# EAGLE design Breakout (EAGLE 9.5.1)
CNAME: ADS131E08 Breakout; CREVISION: 1.0; DESIGNER: Aodhán Murray

## Sheet 1 of 5: ADC Sheet
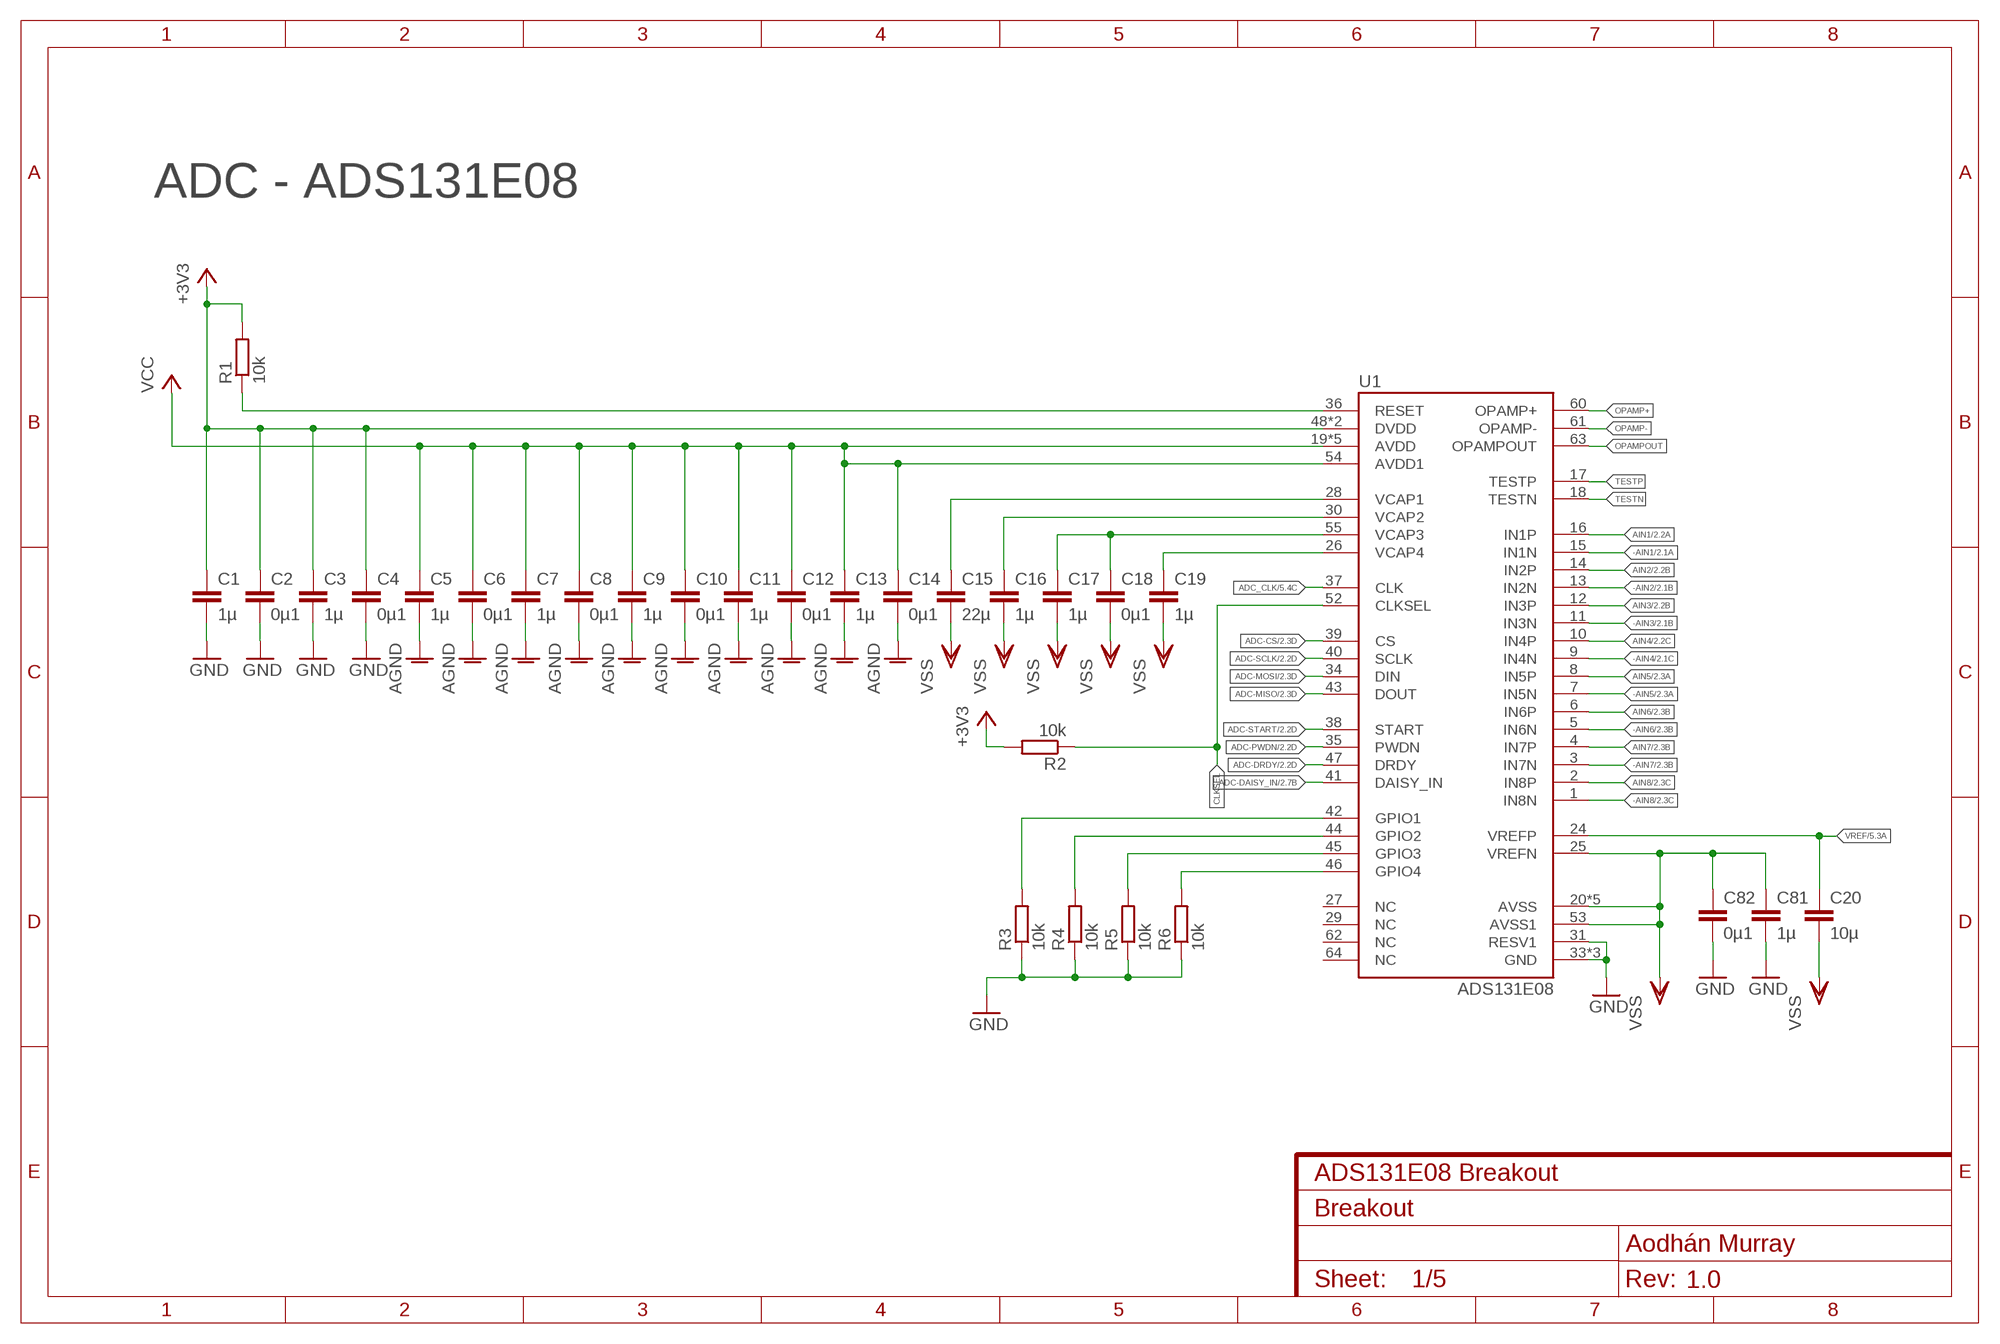
[diagram p0: schematic, sheet 1]

### Parts
C1  1µ  C-EUC0603  [C0603]
C2  0µ1  C-EUC0603  [C0603]
C3  1µ  C-EUC0603  [C0603]
C4  0µ1  C-EUC0603  [C0603]
C5  1µ  C-EUC0603  [C0603]
C6  0µ1  C-EUC0603  [C0603]
C7  1µ  C-EUC0603  [C0603]
C8  0µ1  C-EUC0603  [C0603]
C9  1µ  C-EUC0603  [C0603]
C10  0µ1  C-EUC0603  [C0603]
C11  1µ  C-EUC0603  [C0603]
C12  0µ1  C-EUC0603  [C0603]
C13  1µ  C-EUC0603  [C0603]
C14  0µ1  C-EUC0603  [C0603]
C15  22µ  C-EUC0603  [C0603]
C16  1µ  C-EUC0603  [C0603]
C17  1µ  C-EUC0603  [C0603]
C18  0µ1  C-EUC0603  [C0603]
C19  1µ  C-EUC0603  [C0603]
C20  10µ  C-EUC0603  [C0603]
C81  1µ  C-EUC0603  [C0603]
C82  0µ1  C-EUC0603  [C0603]
R1  10k  R-EU_R0603  [R0603]
R2  10k  R-EU_R0603  [R0603]
R3  10k  R-EU_R0603  [R0603]
R4  10k  R-EU_R0603  [R0603]
R5  10k  R-EU_R0603  [R0603]
R6  10k  R-EU_R0603  [R0603]
U1  ADS131E08  [TQFP-64]

### Nets
+3V3: C1.1 C2.1 C3.1 C4.1 R1.2 R2.2 U1.48(DVDD) U1.50(DVDD) ; also sheet 5
-AIN1: U1.15(IN1N) ; also sheet 2
-AIN2: U1.13(IN2N) ; also sheet 2
-AIN3: U1.11(IN3N) ; also sheet 2
-AIN4: U1.9(IN4N) ; also sheet 2
-AIN5: U1.7(IN5N) ; also sheet 2
-AIN6: U1.5(IN6N) ; also sheet 2
-AIN7: U1.3(IN7N) ; also sheet 2
-AIN8: U1.1(IN8N) ; also sheet 2
ADC-CS: U1.39(CS) ; also sheet 2
ADC-DAISY_IN: U1.41(DAISY_IN) ; also sheet 2
ADC-DRDY: U1.47(DRDY) ; also sheet 2
ADC-MISO: U1.43(DOUT) ; also sheet 2
ADC-MOSI: U1.34(DIN) ; also sheet 2
ADC-PWDN: U1.35(PWDN) ; also sheet 2
ADC-RST: R1.1 U1.36(RESET) ; also sheet 2
ADC-SCLK: U1.40(SCLK) ; also sheet 2
ADC-START: U1.38(START) ; also sheet 2
ADC_CLK: U1.37(CLK) ; also sheet 5
AIN1: U1.16(IN1P) ; also sheet 2
AIN2: U1.14(IN2P) ; also sheet 2
AIN3: U1.12(IN3P) ; also sheet 2
AIN4: U1.10(IN4P) ; also sheet 2
AIN5: U1.8(IN5P) ; also sheet 2
AIN6: U1.6(IN6P) ; also sheet 2
AIN7: U1.4(IN7P) ; also sheet 2
AIN8: U1.2(IN8P) ; also sheet 2
CLKSEL: R2.1 U1.52(CLKSEL)
GND: C1.2 C2.2 C3.2 C4.2 C5.2 C6.2 C7.2 C8.2 C9.2 C10.2 C11.2 C12.2 C13.2 C14.2 C81.2 C82.2 R3.1 R4.1 R5.1 R6.1 U1.31(RESV1) U1.33(GND) U1.49(GND) U1.51(GND) ; supply symbol labelled AGND ; also sheet 2,3,4,5
GPIO1: R3.2 U1.42(GPIO1)
GPIO2: R4.2 U1.44(GPIO2)
GPIO3: R5.2 U1.45(GPIO3)
GPIO4: R6.2 U1.46(GPIO4)
OPAMP+: U1.60(OPAMP+)
OPAMP-: U1.61(OPAMP-)
OPAMPOUT: U1.63(OPAMPOUT)
TESTN: U1.18(TESTN)
TESTP: U1.17(TESTP)
VCAP1: C15.1 U1.28(VCAP1)
VCAP2: C16.1 U1.30(VCAP2)
VCAP3: C17.1 C18.1 U1.55(VCAP3)
VCAP4: C19.1 U1.26(VCAP4)
VCC: C5.1 C6.1 C7.1 C8.1 C9.1 C10.1 C11.1 C12.1 C13.1 C14.1 U1.19(AVDD) U1.21(AVDD) U1.22(AVDD) U1.54(AVDD1) U1.56(AVDD) U1.59(AVDD) ; also sheet 3,4,5
VREF: C20.1 U1.24(VREFP) ; also sheet 5
VSS: C15.2 C16.2 C17.2 C18.2 C19.2 C20.2 C81.1 C82.1 U1.20(AVSS) U1.23(AVSS) U1.25(VREFN) U1.32(AVSS) U1.53(AVSS1) U1.57(AVSS) U1.58(AVSS) ; also sheet 3,4,5
Unconnected: U1.27(NC) U1.29(NC) U1.62(NC) U1.64(NC)

### Notes on the sheet
- ADC - ADS131E08

## Sheet 2 of 5: Connectors
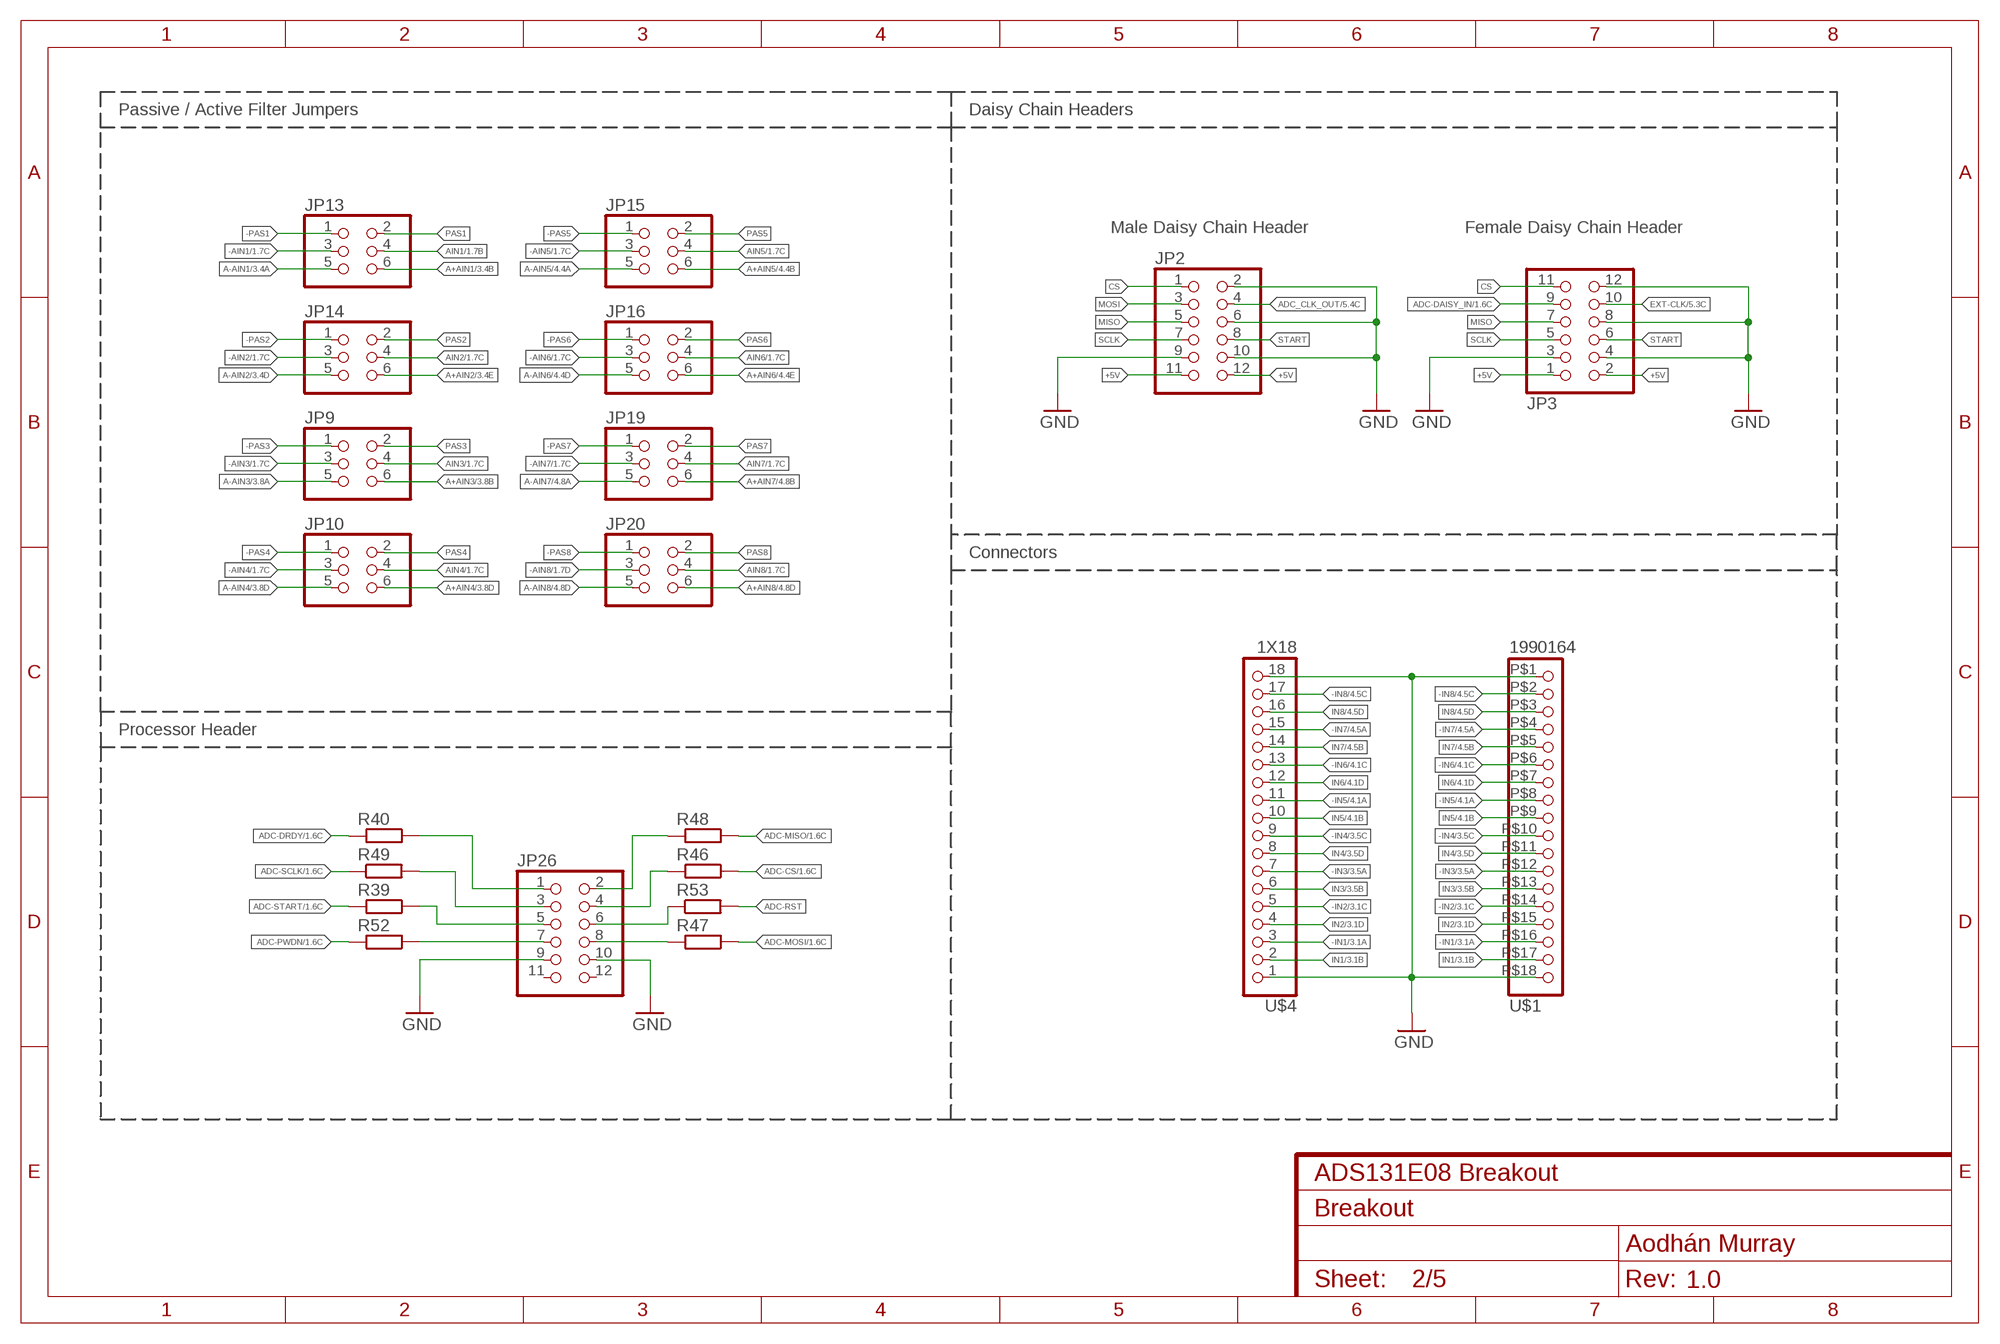
[diagram p1: schematic, sheet 2]

### Parts
JP2  PINHD-2X6/90  [2X06/90]
JP3  PINHD-2X6/90  [2X06/90]
JP9  PINHD-2X3  [2X03]
JP10  PINHD-2X3  [2X03]
JP13  PINHD-2X3  [2X03]
JP14  PINHD-2X3  [2X03]
JP15  PINHD-2X3  [2X03]
JP16  PINHD-2X3  [2X03]
JP19  PINHD-2X3  [2X03]
JP20  PINHD-2X3  [2X03]
JP26  PINHD-2X6/90  [2X06/90]
R39  R-EU_R0603  [R0603]
R40  R-EU_R0603  [R0603]
R46  R-EU_R0603  [R0603]
R47  R-EU_R0603  [R0603]
R48  R-EU_R0603  [R0603]
R49  R-EU_R0603  [R0603]
R52  R-EU_R0603  [R0603]
R53  R-EU_R0603  [R0603]
U$1  1990164  [PTSA-2.5-Z]
U$4  1X18  [1X18/90]

### Nets
+5V: JP2.11 JP2.12 JP3.1 JP3.2 ; also sheet 5
-AIN1: JP13.3 ; also sheet 1
-AIN2: JP14.3 ; also sheet 1
-AIN3: JP9.3 ; also sheet 1
-AIN4: JP10.3 ; also sheet 1
-AIN5: JP15.3 ; also sheet 1
-AIN6: JP16.3 ; also sheet 1
-AIN7: JP19.3 ; also sheet 1
-AIN8: JP20.3 ; also sheet 1
-IN1: U$1.P$16 U$4.3 ; also sheet 3
-IN2: U$1.P$14 U$4.5 ; also sheet 3
-IN3: U$1.P$12 U$4.7 ; also sheet 3
-IN4: U$1.P$10 U$4.9 ; also sheet 3
-IN5: U$1.P$8 U$4.11 ; also sheet 4
-IN6: U$1.P$6 U$4.13 ; also sheet 4
-IN7: U$1.P$4 U$4.15 ; also sheet 4
-IN8: U$1.P$2 U$4.17 ; also sheet 4
-PAS1: JP13.1 ; also sheet 3
-PAS2: JP14.1 ; also sheet 3
-PAS3: JP9.1 ; also sheet 3
-PAS4: JP10.1 ; also sheet 3
-PAS5: JP15.1 ; also sheet 4
-PAS6: JP16.1 ; also sheet 4
-PAS7: JP19.1 ; also sheet 4
-PAS8: JP20.1 ; also sheet 4
A+AIN1: JP13.6 ; also sheet 3
A+AIN2: JP14.6 ; also sheet 3
A+AIN3: JP9.6 ; also sheet 3
A+AIN4: JP10.6 ; also sheet 3
A+AIN5: JP15.6 ; also sheet 4
A+AIN6: JP16.6 ; also sheet 4
A+AIN7: JP19.6 ; also sheet 4
A+AIN8: JP20.6 ; also sheet 4
A-AIN1: JP13.5 ; also sheet 3
A-AIN2: JP14.5 ; also sheet 3
A-AIN3: JP9.5 ; also sheet 3
A-AIN4: JP10.5 ; also sheet 3
A-AIN5: JP15.5 ; also sheet 4
A-AIN6: JP16.5 ; also sheet 4
A-AIN7: JP19.5 ; also sheet 4
A-AIN8: JP20.5 ; also sheet 4
ADC-CS: R46.1 ; also sheet 1
ADC-DAISY_IN: JP3.9 ; also sheet 1
ADC-DRDY: R40.2 ; also sheet 1
ADC-MISO: R48.1 ; also sheet 1
ADC-MOSI: R47.1 ; also sheet 1
ADC-PWDN: R52.2 ; also sheet 1
ADC-RST: R53.2 ; also sheet 1
ADC-SCLK: R49.1 ; also sheet 1
ADC-START: R39.2 ; also sheet 1
ADC_CLK_OUT: JP2.4 ; also sheet 5
AIN1: JP13.4 ; also sheet 1
AIN2: JP14.4 ; also sheet 1
AIN3: JP9.4 ; also sheet 1
AIN4: JP10.4 ; also sheet 1
AIN5: JP15.4 ; also sheet 1
AIN6: JP16.4 ; also sheet 1
AIN7: JP19.4 ; also sheet 1
AIN8: JP20.4 ; also sheet 1
CS: JP2.1 JP3.11 JP26.4 R46.2
DRDY: JP26.1 R40.1 ; also sheet 5
EXT-CLK: JP3.10 ; also sheet 5
GND: JP2.2 JP2.6 JP2.9 JP2.10 JP3.3 JP3.4 JP3.8 JP3.12 JP26.9 JP26.10 U$1.P$1 U$1.P$18 U$4.1 U$4.18 ; also sheet 1,3,4,5
IN1: U$1.P$17 U$4.2 ; also sheet 3
IN2: U$1.P$15 U$4.4 ; also sheet 3
IN3: U$1.P$13 U$4.6 ; also sheet 3
IN4: U$1.P$11 U$4.8 ; also sheet 3
IN5: U$1.P$9 U$4.10 ; also sheet 4
IN6: U$1.P$7 U$4.12 ; also sheet 4
IN7: U$1.P$5 U$4.14 ; also sheet 4
IN8: U$1.P$3 U$4.16 ; also sheet 4
MISO: JP2.5 JP3.7 JP26.2 R48.2
MOSI: JP2.3 JP26.8 R47.2
PAS1: JP13.2 ; also sheet 3
PAS2: JP14.2 ; also sheet 3
PAS3: JP9.2 ; also sheet 3
PAS4: JP10.2 ; also sheet 3
PAS5: JP15.2 ; also sheet 4
PAS6: JP16.2 ; also sheet 4
PAS7: JP19.2 ; also sheet 4
PAS8: JP20.2 ; also sheet 4
PWDN: JP26.7 R52.1
RST: JP26.6 R53.1
SCLK: JP2.7 JP3.5 JP26.3 R49.2
START: JP2.8 JP3.6 JP26.5 R39.1
Unconnected: JP26.11 JP26.12

### Notes on the sheet
- Passive / Active Filter Jumpers | Daisy Chain Headers
- Male Daisy Chain Header | Female Daisy Chain Header
- Connectors
- Processor Header

## Sheet 3 of 5: Analog Front-End Sheet 1
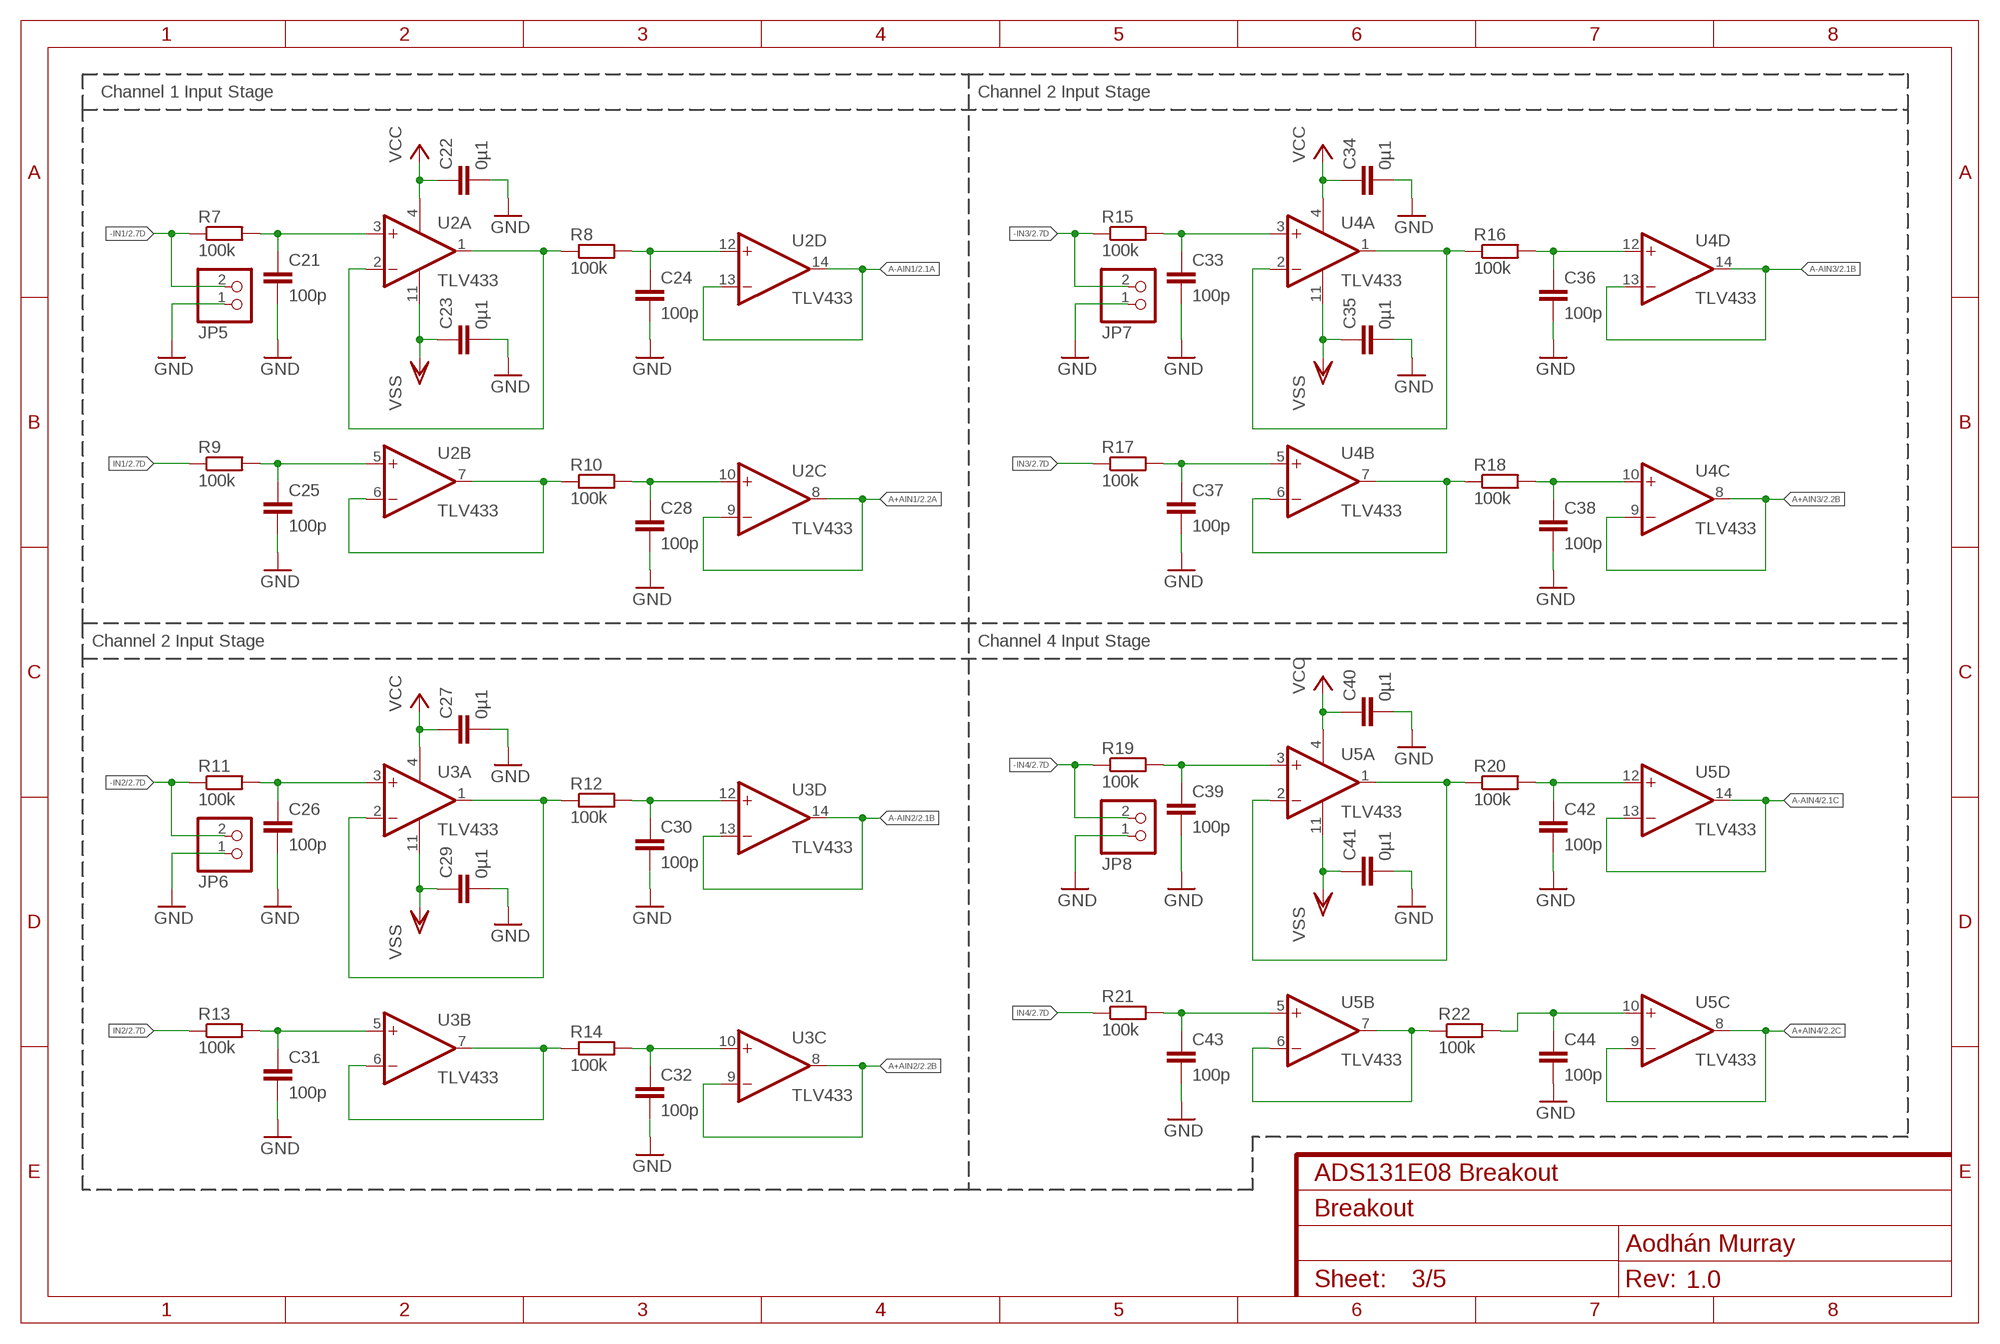
[diagram p2: schematic, sheet 3]

### Parts
C21  100p  C-EUC0603  [C0603]
C22  0µ1  C-EUC0603  [C0603]
C23  0µ1  C-EUC0603  [C0603]
C24  100p  C-EUC0603  [C0603]
C25  100p  C-EUC0603  [C0603]
C26  100p  C-EUC0603  [C0603]
C27  0µ1  C-EUC0603  [C0603]
C28  100p  C-EUC0603  [C0603]
C29  0µ1  C-EUC0603  [C0603]
C30  100p  C-EUC0603  [C0603]
C31  100p  C-EUC0603  [C0603]
C32  100p  C-EUC0603  [C0603]
C33  100p  C-EUC0603  [C0603]
C34  0µ1  C-EUC0603  [C0603]
C35  0µ1  C-EUC0603  [C0603]
C36  100p  C-EUC0603  [C0603]
C37  100p  C-EUC0603  [C0603]
C38  100p  C-EUC0603  [C0603]
C39  100p  C-EUC0603  [C0603]
C40  0µ1  C-EUC0603  [C0603]
C41  0µ1  C-EUC0603  [C0603]
C42  100p  C-EUC0603  [C0603]
C43  100p  C-EUC0603  [C0603]
C44  100p  C-EUC0603  [C0603]
JP5  PINHD-1X2  [1X02]
JP6  PINHD-1X2  [1X02]
JP7  PINHD-1X2  [1X02]
JP8  PINHD-1X2  [1X02]
R7  100k  R-EU_R0603  [R0603]
R8  100k  R-EU_R0603  [R0603]
R9  100k  R-EU_R0603  [R0603]
R10  100k  R-EU_R0603  [R0603]
R11  100k  R-EU_R0603  [R0603]
R12  100k  R-EU_R0603  [R0603]
R13  100k  R-EU_R0603  [R0603]
R14  100k  R-EU_R0603  [R0603]
R15  100k  R-EU_R0603  [R0603]
R16  100k  R-EU_R0603  [R0603]
R17  100k  R-EU_R0603  [R0603]
R18  100k  R-EU_R0603  [R0603]
R19  100k  R-EU_R0603  [R0603]
R20  100k  R-EU_R0603  [R0603]
R21  100k  R-EU_R0603  [R0603]
R22  100k  R-EU_R0603  [R0603]
U2  TLV433  [TSSOP14]
U3  TLV433  [TSSOP14]
U4  TLV433  [TSSOP14]
U5  TLV433  [TSSOP14]

### Nets
-IN1: JP5.2 R7.1 ; also sheet 2
-IN2: JP6.2 R11.1 ; also sheet 2
-IN3: JP7.2 R15.1 ; also sheet 2
-IN4: JP8.2 R19.1 ; also sheet 2
-PAS1: C21.1 R7.2 U2.3(A:+IN) ; also sheet 2
-PAS2: C26.1 R11.2 U3.3(A:+IN) ; also sheet 2
-PAS3: C33.1 R15.2 U4.3(A:+IN) ; also sheet 2
-PAS4: C39.1 R19.2 U5.3(A:+IN) ; also sheet 2
A+AIN1: U2.8(C:OUT) U2.9(C:-IN) ; also sheet 2
A+AIN2: U3.8(C:OUT) U3.9(C:-IN) ; also sheet 2
A+AIN3: U4.8(C:OUT) U4.9(C:-IN) ; also sheet 2
A+AIN4: U5.8(C:OUT) U5.9(C:-IN) ; also sheet 2
A-AIN1: U2.13(D:-IN) U2.14(D:OUT) ; also sheet 2
A-AIN2: U3.13(D:-IN) U3.14(D:OUT) ; also sheet 2
A-AIN3: U4.13(D:-IN) U4.14(D:OUT) ; also sheet 2
A-AIN4: U5.13(D:-IN) U5.14(D:OUT) ; also sheet 2
GND: C21.2 C22.2 C23.2 C24.2 C25.2 C26.2 C27.2 C28.2 C29.2 C30.2 C31.2 C32.2 C33.2 C34.2 C35.2 C36.2 C37.2 C38.2 C39.2 C40.2 C41.2 C42.2 C43.2 C44.2 JP5.1 JP6.1 JP7.1 JP8.1 ; also sheet 1,2,4,5
IN1: R9.1 ; also sheet 2
IN2: R13.1 ; also sheet 2
IN3: R17.1 ; also sheet 2
IN4: R21.1 ; also sheet 2
N$2: C36.1 R16.2 U4.12(D:+IN)
N$3: R16.1 U4.1(A:OUT) U4.2(A:-IN)
N$4: C28.1 R10.2 U2.10(C:+IN)
N$5: C24.1 R8.2 U2.12(D:+IN)
N$6: R8.1 U2.1(A:OUT) U2.2(A:-IN)
N$7: R10.1 U2.6(B:-IN) U2.7(B:OUT)
N$8: C38.1 R18.2 U4.10(C:+IN)
N$9: C30.1 R12.2 U3.12(D:+IN)
N$10: R12.1 U3.1(A:OUT) U3.2(A:-IN)
N$11: R18.1 U4.6(B:-IN) U4.7(B:OUT)
N$12: C32.1 R14.2 U3.10(C:+IN)
N$13: R14.1 U3.6(B:-IN) U3.7(B:OUT)
N$206: C42.1 R20.2 U5.12(D:+IN)
N$207: R20.1 U5.1(A:OUT) U5.2(A:-IN)
N$208: C44.1 R22.2 U5.10(C:+IN)
N$209: R22.1 U5.6(B:-IN) U5.7(B:OUT)
PAS1: C25.1 R9.2 U2.5(B:+IN) ; also sheet 2
PAS2: C31.1 R13.2 U3.5(B:+IN) ; also sheet 2
PAS3: C37.1 R17.2 U4.5(B:+IN) ; also sheet 2
PAS4: C43.1 R21.2 U5.5(B:+IN) ; also sheet 2
VCC: C22.1 C27.1 C34.1 C40.1 U2.4(A:V+) U3.4(A:V+) U4.4(A:V+) U5.4(A:V+) ; also sheet 1,4,5
VSS: C23.1 C29.1 C35.1 C41.1 U2.11(A:V-) U3.11(A:V-) U4.11(A:V-) U5.11(A:V-) ; also sheet 1,4,5

### Notes on the sheet
- Channel 1 Input Stage | Channel 2 Input Stage
- Channel 2 Input Stage | Channel 4 Input Stage

## Sheet 4 of 5: Analog Front-End Sheet 2
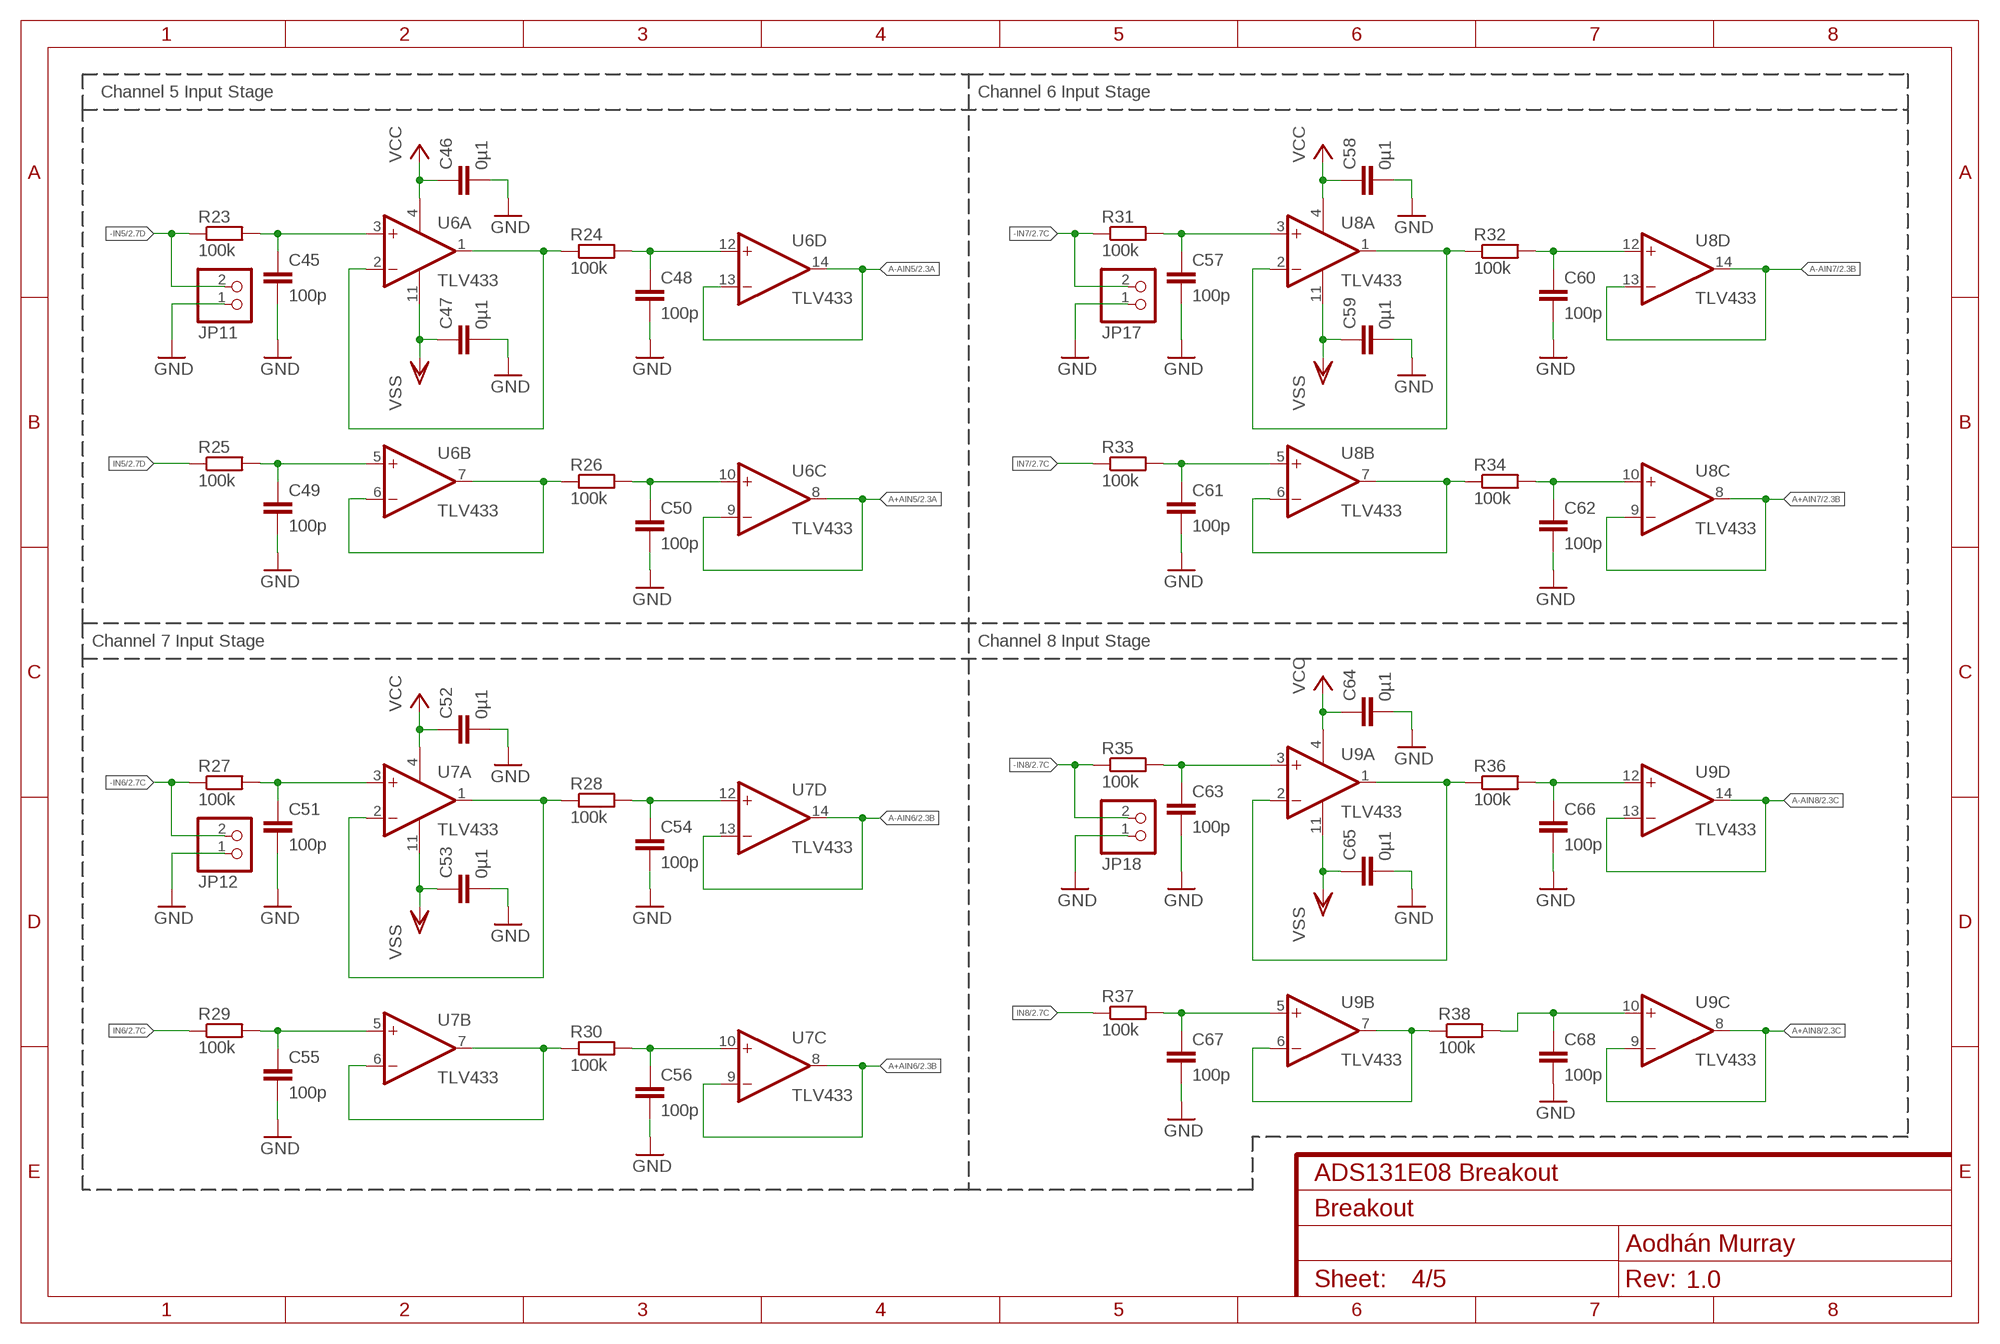
[diagram p3: schematic, sheet 4]

### Parts
C45  100p  C-EUC0603  [C0603]
C46  0µ1  C-EUC0603  [C0603]
C47  0µ1  C-EUC0603  [C0603]
C48  100p  C-EUC0603  [C0603]
C49  100p  C-EUC0603  [C0603]
C50  100p  C-EUC0603  [C0603]
C51  100p  C-EUC0603  [C0603]
C52  0µ1  C-EUC0603  [C0603]
C53  0µ1  C-EUC0603  [C0603]
C54  100p  C-EUC0603  [C0603]
C55  100p  C-EUC0603  [C0603]
C56  100p  C-EUC0603  [C0603]
C57  100p  C-EUC0603  [C0603]
C58  0µ1  C-EUC0603  [C0603]
C59  0µ1  C-EUC0603  [C0603]
C60  100p  C-EUC0603  [C0603]
C61  100p  C-EUC0603  [C0603]
C62  100p  C-EUC0603  [C0603]
C63  100p  C-EUC0603  [C0603]
C64  0µ1  C-EUC0603  [C0603]
C65  0µ1  C-EUC0603  [C0603]
C66  100p  C-EUC0603  [C0603]
C67  100p  C-EUC0603  [C0603]
C68  100p  C-EUC0603  [C0603]
JP11  PINHD-1X2  [1X02]
JP12  PINHD-1X2  [1X02]
JP17  PINHD-1X2  [1X02]
JP18  PINHD-1X2  [1X02]
R23  100k  R-EU_R0603  [R0603]
R24  100k  R-EU_R0603  [R0603]
R25  100k  R-EU_R0603  [R0603]
R26  100k  R-EU_R0603  [R0603]
R27  100k  R-EU_R0603  [R0603]
R28  100k  R-EU_R0603  [R0603]
R29  100k  R-EU_R0603  [R0603]
R30  100k  R-EU_R0603  [R0603]
R31  100k  R-EU_R0603  [R0603]
R32  100k  R-EU_R0603  [R0603]
R33  100k  R-EU_R0603  [R0603]
R34  100k  R-EU_R0603  [R0603]
R35  100k  R-EU_R0603  [R0603]
R36  100k  R-EU_R0603  [R0603]
R37  100k  R-EU_R0603  [R0603]
R38  100k  R-EU_R0603  [R0603]
U6  TLV433  [TSSOP14]
U7  TLV433  [TSSOP14]
U8  TLV433  [TSSOP14]
U9  TLV433  [TSSOP14]

### Nets
-IN5: JP11.2 R23.1 ; also sheet 2
-IN6: JP12.2 R27.1 ; also sheet 2
-IN7: JP17.2 R31.1 ; also sheet 2
-IN8: JP18.2 R35.1 ; also sheet 2
-PAS5: C45.1 R23.2 U6.3(A:+IN) ; also sheet 2
-PAS6: C51.1 R27.2 U7.3(A:+IN) ; also sheet 2
-PAS7: C57.1 R31.2 U8.3(A:+IN) ; also sheet 2
-PAS8: C63.1 R35.2 U9.3(A:+IN) ; also sheet 2
A+AIN5: U6.8(C:OUT) U6.9(C:-IN) ; also sheet 2
A+AIN6: U7.8(C:OUT) U7.9(C:-IN) ; also sheet 2
A+AIN7: U8.8(C:OUT) U8.9(C:-IN) ; also sheet 2
A+AIN8: U9.8(C:OUT) U9.9(C:-IN) ; also sheet 2
A-AIN5: U6.13(D:-IN) U6.14(D:OUT) ; also sheet 2
A-AIN6: U7.13(D:-IN) U7.14(D:OUT) ; also sheet 2
A-AIN7: U8.13(D:-IN) U8.14(D:OUT) ; also sheet 2
A-AIN8: U9.13(D:-IN) U9.14(D:OUT) ; also sheet 2
GND: C45.2 C46.2 C47.2 C48.2 C49.2 C50.2 C51.2 C52.2 C53.2 C54.2 C55.2 C56.2 C57.2 C58.2 C59.2 C60.2 C61.2 C62.2 C63.2 C64.2 C65.2 C66.2 C67.2 C68.2 JP11.1 JP12.1 JP17.1 JP18.1 ; also sheet 1,2,3,5
IN5: R25.1 ; also sheet 2
IN6: R29.1 ; also sheet 2
IN7: R33.1 ; also sheet 2
IN8: R37.1 ; also sheet 2
N$2577: C48.1 R24.2 U6.12(D:+IN)
N$2578: R24.1 U6.1(A:OUT) U6.2(A:-IN)
N$2579: C50.1 R26.2 U6.10(C:+IN)
N$2580: R26.1 U6.6(B:-IN) U6.7(B:OUT)
N$2581: C54.1 R28.2 U7.12(D:+IN)
N$2582: R28.1 U7.1(A:OUT) U7.2(A:-IN)
N$2583: C56.1 R30.2 U7.10(C:+IN)
N$2584: R30.1 U7.6(B:-IN) U7.7(B:OUT)
N$2585: C60.1 R32.2 U8.12(D:+IN)
N$2586: R32.1 U8.1(A:OUT) U8.2(A:-IN)
N$2587: C62.1 R34.2 U8.10(C:+IN)
N$2588: R34.1 U8.6(B:-IN) U8.7(B:OUT)
N$2589: C66.1 R36.2 U9.12(D:+IN)
N$2590: R36.1 U9.1(A:OUT) U9.2(A:-IN)
N$2591: C68.1 R38.2 U9.10(C:+IN)
N$2592: R38.1 U9.6(B:-IN) U9.7(B:OUT)
PAS5: C49.1 R25.2 U6.5(B:+IN) ; also sheet 2
PAS6: C55.1 R29.2 U7.5(B:+IN) ; also sheet 2
PAS7: C61.1 R33.2 U8.5(B:+IN) ; also sheet 2
PAS8: C67.1 R37.2 U9.5(B:+IN) ; also sheet 2
VCC: C46.1 C52.1 C58.1 C64.1 U6.4(A:V+) U7.4(A:V+) U8.4(A:V+) U9.4(A:V+) ; also sheet 1,3,5
VSS: C47.1 C53.1 C59.1 C65.1 U6.11(A:V-) U7.11(A:V-) U8.11(A:V-) U9.11(A:V-) ; also sheet 1,3,5

### Notes on the sheet
- Channel 5 Input Stage | Channel 6 Input Stage
- Channel 7 Input Stage | Channel 8 Input Stage

## Sheet 5 of 5: Voltage Regulation / Reference and Clocking
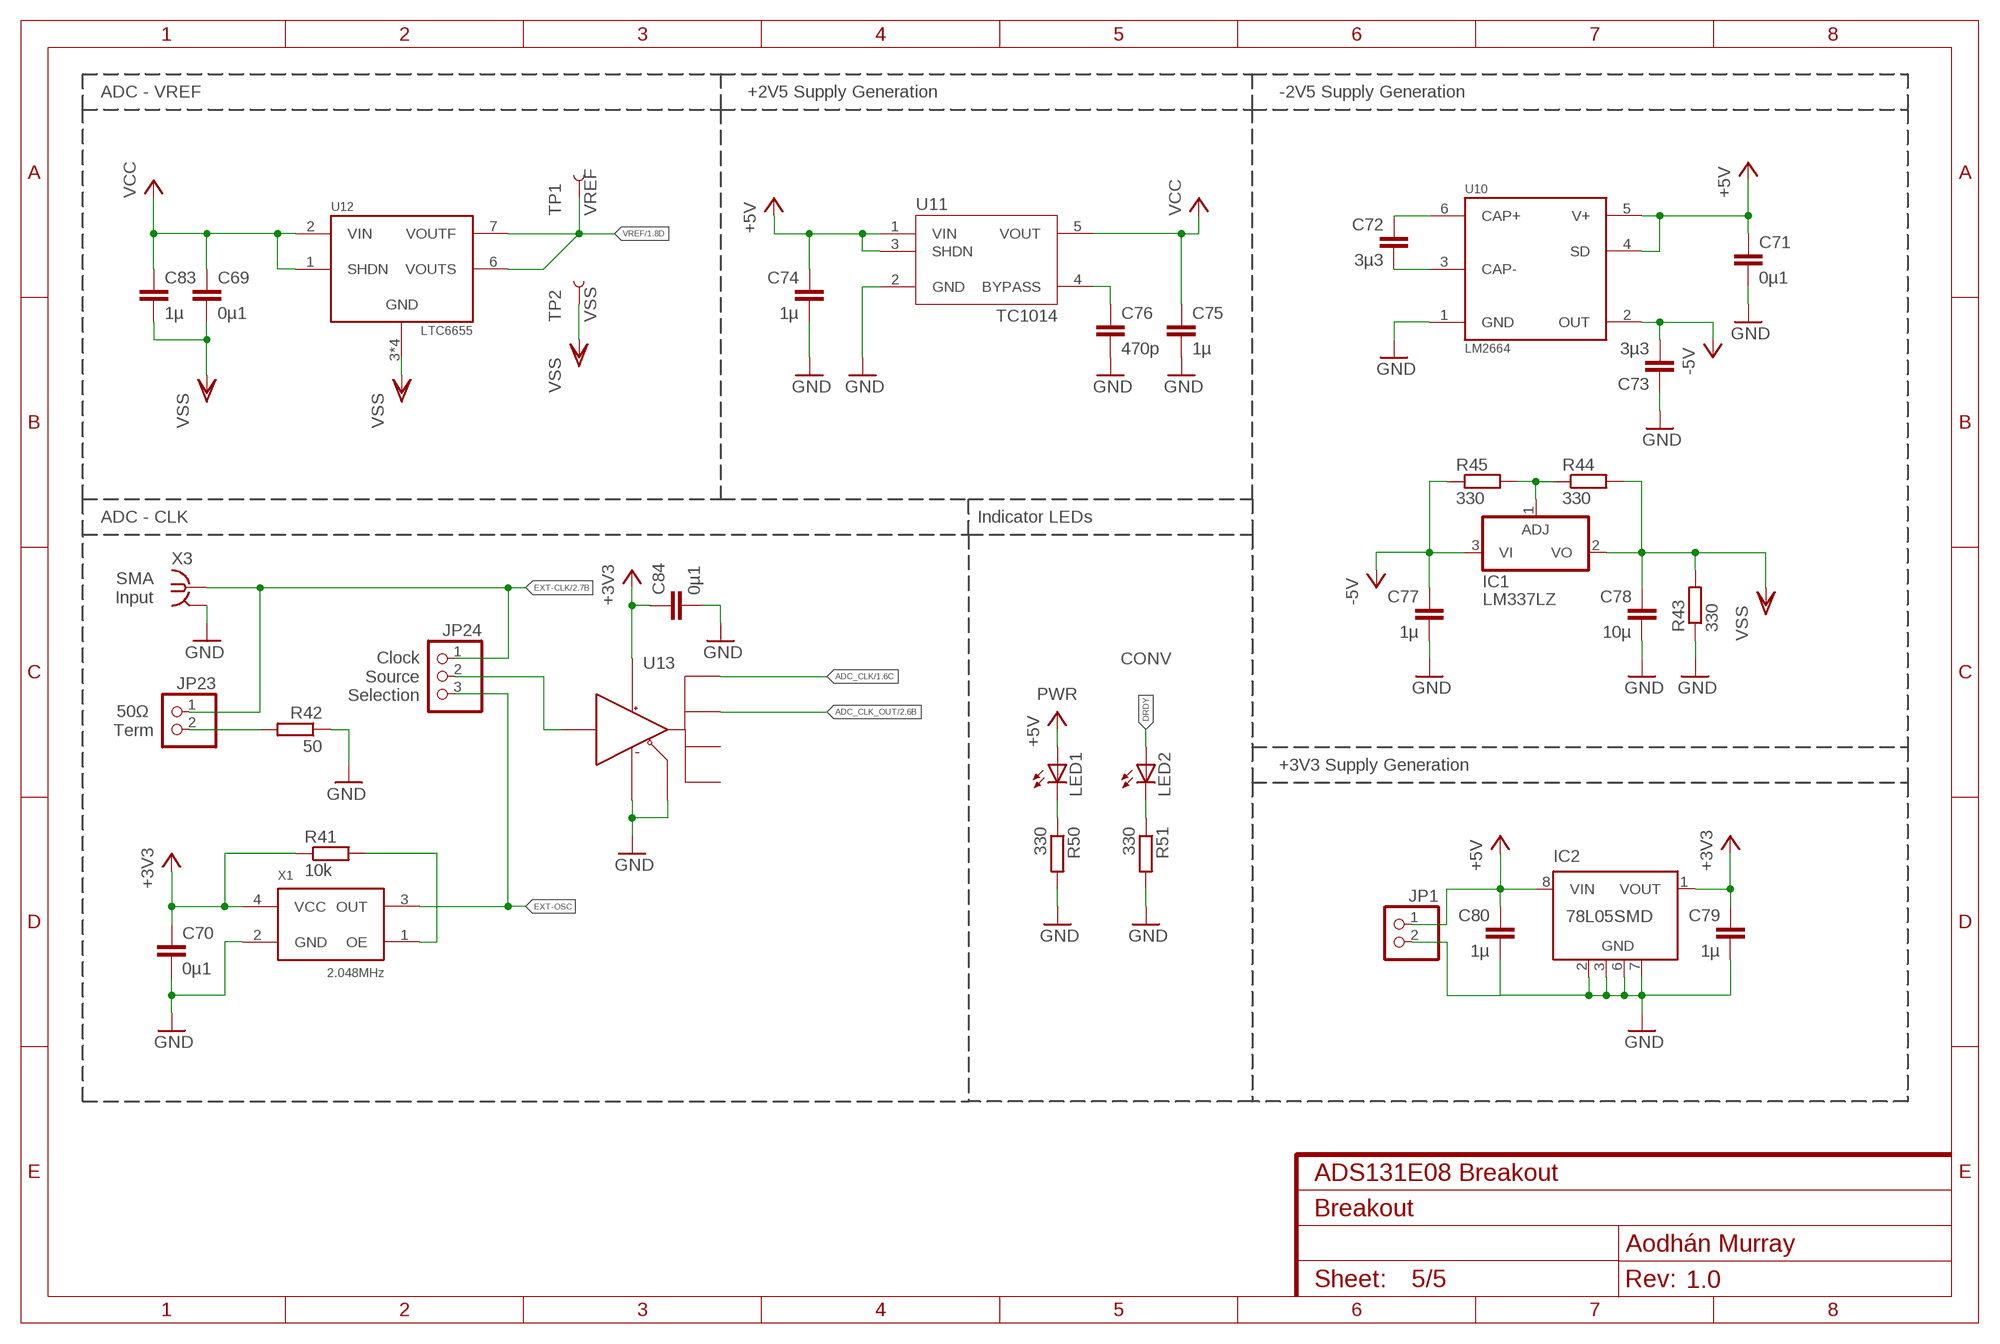
[diagram p4: schematic, sheet 5]

### Parts
C69  0µ1  C-EUC0603  [C0603]
C70  0µ1  C-EUC0603  [C0603]
C71  0µ1  C-EUC0603  [C0603]
C72  3µ3  C-EUC0805  [C0805]
C73  3µ3  C-EUC0805  [C0805]
C74  1µ  C-EUC0805  [C0805]
C75  1µ  C-EUC0805  [C0805]
C76  470p  C-EUC0603  [C0603]
C77  1µ  C-EUC0805  [C0805]
C78  10µ  C-EUC0805  [C0805]
C79  1µ  C-EUC0805  [C0805]
C80  1µ  C-EUC0805  [C0805]
C83  1µ  C-EUC0603  [C0603]
C84  0µ1  C-EUC0603  [C0603]
IC1  LM337LZ  [TO92]
IC2  78L05SMD  [SO08]
JP1  PINHD-1X2  [1X02]
JP23  PINHD-1X2  [1X02]
JP24  PINHD-1X3  [1X03]
LED1  LEDCHIP-LED0805  [CHIP-LED0805]
LED2  LEDCHIP-LED0805  [CHIP-LED0805]
R41  10k  R-EU_R0603  [R0603]
R42  50  R-EU_R0603  [R0603]
R43  330  R-EU_R0603  [R0603]
R44  330  R-EU_R0603  [R0603]
R45  330  R-EU_R0603  [R0603]
R50  330  R-EU_R0603  [R0603]
R51  330  R-EU_R0603  [R0603]
TP1  VREF  TEST-POINT3  [PAD.03X.03]
TP2  VSS  TEST-POINT3  [PAD.03X.03]
U10  LM2664  [SOT23-6]
U11  TC1014  [SOT23-5L]
U12  LTC6655  [LS8]
U13  74AVC9112GTX  [XFDFN-8]
X1  2.048MHz  SG5032CAN  [SG5032CAN]
X3  BU-SMA-V  [BU-SMA-V]

### Nets
+3V3: C70.1 C79.1 C84.1 IC2.1(VOUT) R41.1 U13.P$1(VCC) X1.4(VCC) ; also sheet 1
+5V: C71.1 C74.1 C80.1 IC2.8(VIN) JP1.1 LED1.A U10.4(SD) U10.5(V+) U11.1(VIN) U11.3(SHDN) ; also sheet 2
-5V: C73.2 C77.1 IC1.3(VI) R45.1 U10.2(OUT)
ADC_CLK: U13.P$5(Y1) ; also sheet 1
ADC_CLK_OUT: U13.P$6(Y2) ; also sheet 2
DRDY: LED2.A ; also sheet 2
EXT-CLK: JP23.1 JP24.1 X3.1 ; also sheet 2
EXT-OSC: JP24.3 X1.3(OUT)
GND: C70.2 C71.2 C73.1 C74.2 C75.2 C76.2 C77.2 C78.2 C79.2 C80.2 C84.2 IC2.2(GND) IC2.3(GND) IC2.6(GND) IC2.7(GND) JP1.2 R42.1 R43.1 R50.2 R51.2 U10.1(GND) U11.2(GND) U13.P$3(OE) U13.P$4(GND) X1.2(GND) X3.2 X3.3 X3.4 X3.5 ; also sheet 1,2,3,4
N$1: R41.2 X1.1(OE)
N$6434: C72.1 U10.6(CAP+)
N$6435: C72.2 U10.3(CAP-)
N$6436: JP24.2 U13.P$2(A)
N$6437: JP23.2 R42.2
N$6438: C76.1 U11.4(BYPASS)
N$6439: IC1.1(ADJ) R44.1 R45.2
N$6444: LED2.C R51.1
N$6445: LED1.C R50.1
VCC: C69.1 C75.1 C83.1 U11.5(VOUT) U12.1(SHDN) U12.2(VIN) ; also sheet 1,3,4
VREF: TP1.P$1 U12.6(VOUTS) U12.7(VOUTF) ; also sheet 1
VSS: C69.2 C78.1 C83.2 IC1.2(VO) R43.2 R44.2 TP2.P$1 U12.3(GND) U12.4(GND) U12.5(GND) U12.8(GND) ; also sheet 1,3,4
Unconnected: IC2.4(NC) IC2.5(NC) U13.P$7(Y3) U13.P$8(Y4)

### Notes on the sheet
- ADC - VREF | +2V5 Supply Generation | -2V5 Supply Generation
- ADC - CLK | Indicator LEDs
- SMA
  Input
- CONV
- Clock
  Source
  Selection
- PWR
- 50Ω 
  Term
- +3V3 Supply Generation

## Library data of the parts
C1-C20 C81 C82 = rcl:C-EU: CAPACITOR, European symbol; SPICEPREFIX: C
C21-C80 C83 C84 = resistor:C-EU: CAPACITOR, European symbol
IC1 = linear:*337: Negative VOLTAGE REGULATOR
IC2 = linear:78L*SMD: Positive VOLTAGE REGULATOR
JP1 JP5-JP8 JP11 JP12 JP17 JP18 JP23 = pinhead:PINHD-1X2: PIN HEADER
JP2 JP3 JP26 = pinhead:PINHD-2X6: PIN HEADER
JP9 JP10 JP13-JP16 JP19 JP20 = pinhead:PINHD-2X3: PIN HEADER
JP24 = pinhead:PINHD-1X3: PIN HEADER
LED1 LED2 = adafruit:LED: LED OSRAM: - CHIPLED LG R971, LG N971, LY N971, LG Q971, LY Q971, LO R971, LY R971 LH N974, LH R974 LS Q976, LO Q976, LY Q976 LO Q996 - Hyper CHIPLED LW Q18S LB Q993, LB Q99A, LB R99A - SideLED LS A670, LO A670, LY A670, LG A670, LP A670 LB A673, LV A673, LT A673, LW A673 LH A674 LY A675 LS A676, LA A676, LO A676, LY A676, LW A676 LS A679, LY A679, LG A679 - Hyper Micro SIDELED® LS Y876, LA Y876, LO Y876, LY Y876 LT Y87S - SmartLED LW L88C, LW L88S LB L89C, LB L89S, LG L890 LS L89K, LO L89K, LY L89K LS L896, LA L896, LO L896, LY L896 - TOPLED LS T670, LO T670, LY T670, LG T670, LP T670 LSG T670, LSP T670, LSY T670, LOP T670, LYG T670 LG T671, LOG T671, LSG T671 LB T673, LV T673, LT T673, LW T673 LH T674 LS T676, LA T676, LO T676, LY T676, LB T676, LH T676, LSB T676, LW T676 LB T67C, LV T67C, LT T67C, LS T67K, LO T67K, LY T67K, LW E67C LS E67B, LA E67B, LO E67B, LY E67B, LB E67C, LV E67C, LT E67C LW T67C LS T679, LY T679, LG T679 LS T770, LO T770, LY T770, LG T770, LP T770 LB T773, LV T773, LT T773, LW T773 LH T774 LS E675, LA E675, LY E675, LS T675 LS T776, LA T776, LO T776, LY T776, LB T776 LHGB T686 LT T68C, LB T68C - Hyper Mini TOPLED® LB M676 - Mini TOPLED Santana® LG M470 LS M47K, LO M47K, LY M47K Source: http://www.osram.convergy.de/
R1-R53 = resistor:R-EU_: RESISTOR, European symbol
TP1 TP2 = SparkFun-Connectors:TEST-POINT: SparkFun Test Points Bare copper test points for troubleshooting or In-Circuit-Testing. These are used by our Production team for verifying production board runs using pogo-pins on test beds. SparkFun Products: SparkFun LSM9DS1 Breakout <https://www.sparkfun.com/products/13284> SparkFun PSOC <https://www.sparkfun.com/products/13714> SparkFun Load Cell Amplifier <https://www.sparkfun.com/products/13879>
U1 = measurement-custom:ADS131E08
U2-U9 = opamp-custom:TLV433
U10 = power-custom:LM2664
U11 = power-custom:TC1014: 2.5V Voltage Regulator
U12 = measurement-custom:LTC6655
U13 = clock-custom:74AVC9112GTX
U$1 = conn-custom:1990164
U$4 = conn-custom:1X18
X1 = crystal-custom:SG5032CAN; VALUE: X-MHz
X3 = con-coax:BU-SMA-V: FEMALE SMA CONNECTOR Radiall distributor RS 112-3794; OC_FARNELL: unknown; OC_NEWARK: unknown

## Board
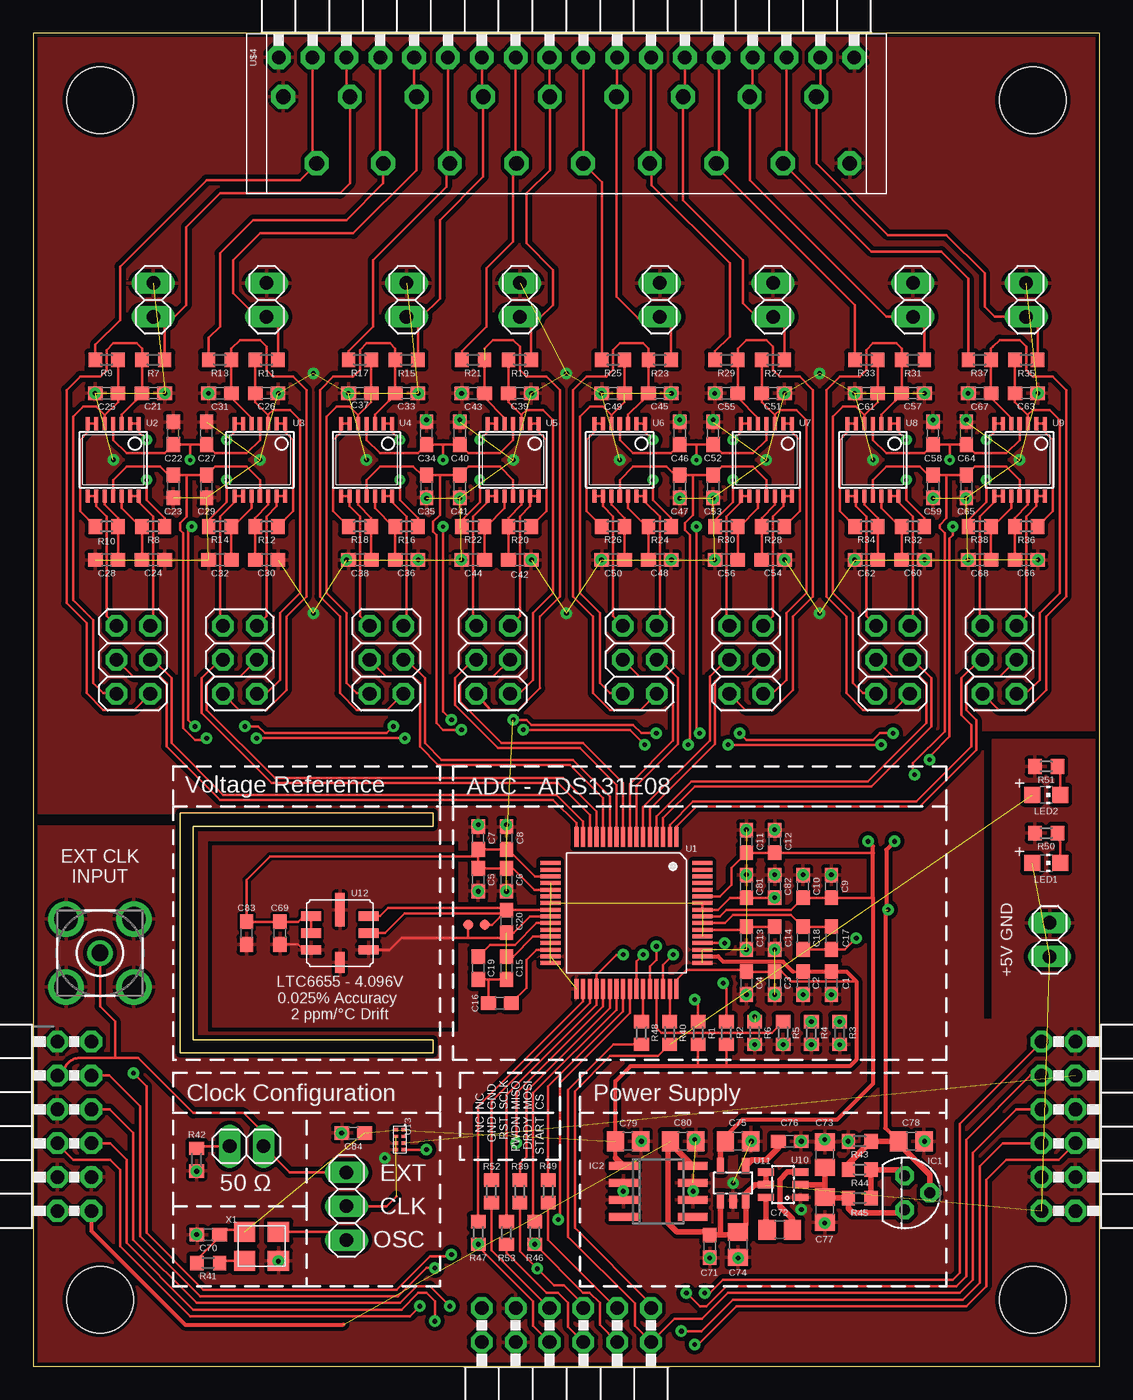
[diagram p5: board, top side]
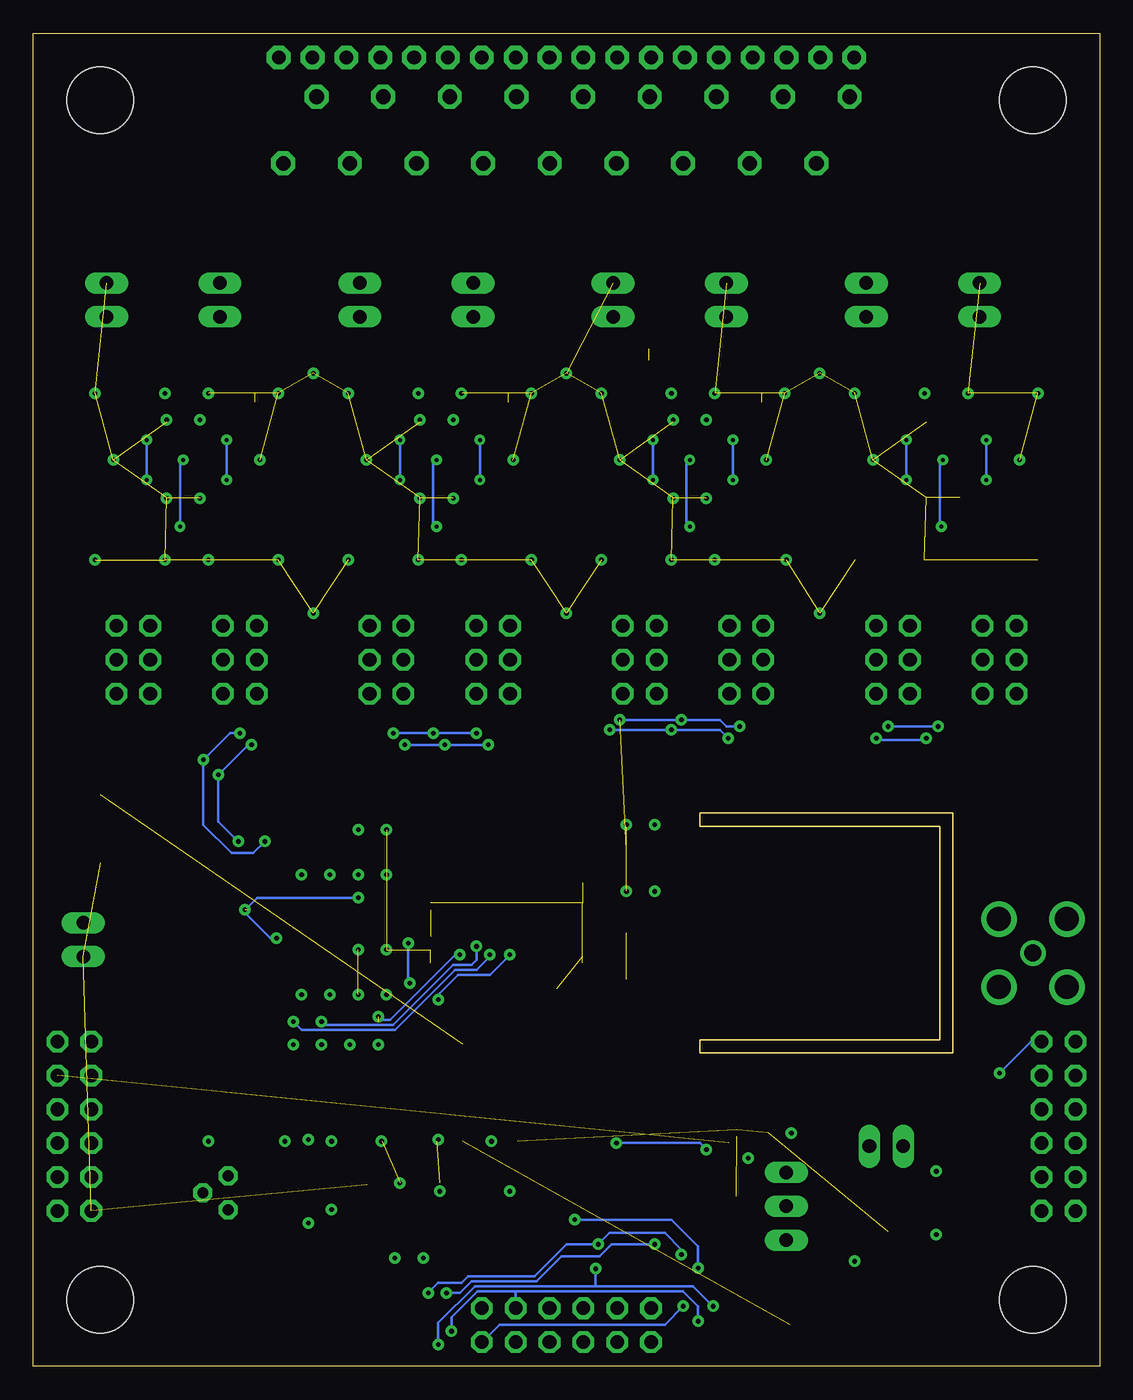
[diagram p6: board, bottom side, seen from below]

Size 80 x 100 mm. Coordinates in mm from the lower left corner, seen from the top.
Outline: 0,0 80,0 80,100 0,100 0,0
Outline: 11,23.5 11,41.5 30,41.5 30,40.5 12,40.5 12,24.5 30,24.5 30,23.5 11,23.5
Copper layers (1*16): Top 0.035mm / dielectric 1.5mm / Bottom 0.035mm
Design rules "SparkFun *": minimum track width 6mil, minimum drill 0.3mm, track to track 6mil, track to pad 6mil, pad to pad 6mil, via to via 6mil, smd to smd 0mil, copper to edge 10mil, drill to drill 8mil, minimum pad ring 12mil, minimum via ring 10mil, stop-mask expansion 4mil, vias tented up to drill 25mil, thermal gap 10mil
Holes 5 mm at 5,5 75,5 75,95 5,95

### Footprints (pad centres in the part's own frame; a part is rotated, then mirrored left to right if it is on the bottom)
C0603 = smd 1.1 x 1: 1 -0.85,0; 2 0.85,0
C0805 = smd 1.3 x 1.5: 1 -0.95,0; 2 0.95,0
TO92 = drill 0.813 octagon: 1 -1.27,0; 2 0,1.905; 3 1.27,0
SO08 = smd 0.6 x 2.2: 1 -1.905,-2.6; 2 -0.635,-2.6; 3 0.635,-2.6; 4 1.905,-2.6; 5 1.905,2.6; 6 0.635,2.6; 7 -0.635,2.6; 8 -1.905,2.6
1X02 = drill 1.016 long: 1 -1.27,0; 2 1.27,0
2X06/90 = drill 1.016 octagon: 1 -6.35,-6.35; 2 -6.35,-3.81; 3 -3.81,-6.35; 4 -3.81,-3.81; 5 -1.27,-6.35; 6 -1.27,-3.81; 7 1.27,-6.35; 8 1.27,-3.81; 9 3.81,-6.35; 10 3.81,-3.81; 11 6.35,-6.35; 12 6.35,-3.81
2X03 = drill 1.016 octagon: 1 -2.54,-1.27; 2 -2.54,1.27; 3 0,-1.27; 4 0,1.27; 5 2.54,-1.27; 6 2.54,1.27
1X03 = drill 1.016 long: 1 -2.54,0; 2 0,0; 3 2.54,0
CHIP-LED0805 = smd 1.2 x 1.2: A 0,-1.05; C 0,1.05
R0603 = smd 1 x 1.1: 1 -0.85,0; 2 0.85,0
PAD.03X.03 = smd 0.762 x 0.762: P$1 0,0
TQFP-64 = smd 1.5 x 0.3: 1 -5.7,3.75; 2 -5.7,3.25; 3 -5.7,2.75; 4 -5.7,2.25; 5 -5.7,1.75; 6 -5.7,1.25; 7 -5.7,0.75; 8 -5.7,0.25; 9 -5.7,-0.25; 10 -5.7,-0.75; 11 -5.7,-1.25; 12 -5.7,-1.75; 13 -5.7,-2.25; 14 -5.7,-2.75; 15 -5.7,-3.25; 16 -5.7,-3.75; 33 5.7,-3.75; 34 5.7,-3.25; 35 5.7,-2.75; 36 5.7,-2.25; 37 5.7,-1.75; 38 5.7,-1.25; 39 5.7,-0.75; 40 5.7,-0.25; 41 5.7,0.25; 42 5.7,0.75; 43 5.7,1.25; 44 5.7,1.75; 45 5.7,2.25; 46 5.7,2.75; 47 5.7,3.25; 48 5.7,3.75 | smd 0.3 x 1.5: 17 -3.75,-5.7; 18 -3.25,-5.7; 19 -2.75,-5.7; 20 -2.25,-5.7; 21 -1.75,-5.7; 22 -1.25,-5.7; 23 -0.75,-5.7; 24 -0.25,-5.7; 25 0.25,-5.7; 26 0.75,-5.7; 27 1.25,-5.7; 28 1.75,-5.7; 29 2.25,-5.7; 30 2.75,-5.7; 31 3.25,-5.7; 32 3.75,-5.7; 49 3.75,5.7; 50 3.25,5.7; 51 2.75,5.7; 52 2.25,5.7; 53 1.75,5.7; 54 1.25,5.7; 55 0.75,5.7; 56 0.25,5.7; 57 -0.25,5.7; 58 -0.75,5.7; 59 -1.25,5.7; 60 -1.75,5.7; 61 -2.25,5.7; 62 -2.75,5.7; 63 -3.25,5.7; 64 -3.75,5.7
TSSOP14 = smd 0.305 x 0.991: 1 -1.905,-2.718; 2 -1.27,-2.718; 3 -0.635,-2.718; 4 0,-2.718; 5 0.635,-2.718; 6 1.27,-2.718; 7 1.905,-2.718; 8 1.905,2.718; 9 1.27,2.718; 10 0.635,2.718; 11 0,2.718; 12 -0.635,2.718; 13 -1.27,2.718; 14 -1.905,2.718
SOT23-6 = smd 0.55 x 1.2: 1 -0.95,-1.3; 2 0,-1.3; 3 0.95,-1.3; 4 0.95,1.3; 5 0,1.3; 6 -0.95,1.3
SOT23-5L = smd 0.55 x 1.2: 1 -0.95,-1.3; 2 0,-1.3; 3 0.95,-1.3; 4 0.95,1.3; 5 -0.95,1.3
LS8 = smd 1.5 x 0.7: 1 -2.15,1.27; 2 -2.15,0; 3 -2.15,-1.27; 5 2.15,-1.27; 6 2.15,0; 7 2.15,1.27 | smd 0.7 x 1.6: 4 0,-2.2 | smd 0.7 x 2.5: 8 0,1.75
XFDFN-8 = smd 0.25 x 0.35: P$1 -0.75,-0.3; P$2 -0.25,-0.3; P$3 0.25,-0.3; P$4 0.75,-0.3; P$5 0.75,0.3; P$6 0.25,0.3; P$7 -0.25,0.3; P$8 -0.75,0.3
PTSA-2.5-Z = drill 1.1 pad 1.778 octagon: P$1 21.25,-2.5; P$2 18.75,2.5; P$3 16.25,-2.5; P$4 13.75,2.5; P$5 11.25,-2.5; P$6 8.75,2.5; P$7 6.25,-2.5; P$8 3.75,2.5; P$9 1.25,-2.5; P$10 -1.25,2.5; P$11 -3.75,-2.5; P$12 -6.25,2.5; P$13 -8.75,-2.5; P$14 -11.25,2.5; P$15 -13.75,-2.5; P$16 -16.25,2.5; P$17 -18.75,-2.5; P$18 -21.25,2.5
1X18/90 = drill 1.016 pad 1.778 octagon: 1 -21.59,-3.81; 2 -19.05,-3.81; 3 -16.51,-3.81; 4 -13.97,-3.81; 5 -11.43,-3.81; 6 -8.89,-3.81; 7 -6.35,-3.81; 8 -3.81,-3.81; 9 -1.27,-3.81; 10 1.27,-3.81; 11 3.81,-3.81; 12 6.35,-3.81; 13 8.89,-3.81; 14 11.43,-3.81; 15 13.97,-3.81; 16 16.51,-3.81; 17 19.05,-3.81; 18 21.59,-3.81
SG5032CAN = smd 1.6 x 1.5: 1 -1.27,-1.1; 2 1.27,-1.1; 3 1.27,1.1; 4 -1.27,1.1
BU-SMA-V = drill 1.27: 1 0,0 | drill 1.778: 2 -2.55,2.55; 3 2.55,2.55; 4 2.55,-2.55; 5 -2.55,-2.55

### Placement (x,y rotation side)
C1  59.88,28.75 270 top
C2  57.75,28.75 270 top
C3  55.62,28.75 270 top
C4  53.5,28.75 270 top
C5  33.38,36.5 270 top
C6  35.5,36.5 270 top
C7  33.38,39.62 90 top
C8  35.5,39.62 90 top
C9  59.88,36 90 top
C10  57.75,36 90 top
C11  53.5,39.38 90 top
C12  55.62,39.38 90 top
C13  53.5,32.12 270 top
C14  55.62,32.12 270 top
C15  35.5,29.88 270 top
C16  35,27.25 180 top
C17  59.88,32.12 270 top
C18  57.75,32.12 270 top
C19  33.38,29.88 270 top
C20  35.5,33.38 270 top
C21  9,73 0 top
C22  10.5,70 90 top
C23  10.5,66 270 top
C24  9,60.5 0 top
C25  5.5,73 180 top
C26  17.5,73 0 top
C27  13,70 90 top
C28  5.5,60.5 180 top
C29  13,66 270 top
C30  17.5,60.5 0 top
C31  14,73 180 top
C32  14,60.5 180 top
C33  28,73 0 top
C34  29.5,70 90 top
C35  29.5,66 270 top
C36  28,60.5 0 top
C37  24.5,73 180 top
C38  24.5,60.5 180 top
C39  36.5,73 0 top
C40  32,70 90 top
C41  32,66 270 top
C42  36.5,60.5 0 top
C43  33,73 180 top
C44  33,60.5 180 top
C45  47,73 0 top
C46  48.5,70 90 top
C47  48.5,66 270 top
C48  47,60.5 0 top
C49  43.5,73 180 top
C50  43.5,60.5 180 top
C51  55.5,73 0 top
C52  51,70 90 top
C53  51,66 270 top
C54  55.5,60.5 0 top
C55  52,73 180 top
C56  52,60.5 180 top
C57  66,73 0 top
C58  67.5,70 90 top
C59  67.5,66 270 top
C60  66,60.5 0 top
C61  62.5,73 180 top
C62  62.5,60.5 180 top
C63  74.5,73 0 top
C64  70,70 90 top
C65  70,66 270 top
C66  74.5,60.5 0 top
C67  71,73 180 top
C68  71,60.5 180 top
C69  18.5,32.5 270 top
C70  13.12,9.88 180 top
C71  50.75,9 270 top
C72  56,10.25 0 top
C73  59.38,15.88 270 top
C74  52.88,9.12 270 top
C75  52.88,16.88 0 top
C76  56.75,16.88 0 top
C77  59.38,11.75 270 top
C78  65.88,16.88 0 top
C79  44.62,16.88 0 top
C80  48.75,16.88 0 top
C81  53.5,36 90 top
C82  55.62,36 90 top
C83  16,32.5 270 top
C84  24,17.5 180 top
IC1  65.38,13 270 top
IC2  46.88,13.12 270 top
JP1  76.25,32 90 top
JP2  82,18 270 top
JP3  -2,18 90 top
JP5  9,80 270 top
JP6  17.5,80 270 top
JP7  28,80 270 top
JP8  36.5,80 270 top
JP9  26.5,53 90 top
JP10  34.5,53 90 top
JP11  47,80 270 top
JP12  55.5,80 270 top
JP13  7.5,53 90 top
JP14  15.5,53 90 top
JP15  45.5,53 90 top
JP16  53.5,53 90 top
JP17  66,80 270 top
JP18  74.5,80 270 top
JP19  64.5,53 90 top
JP20  72.5,53 90 top
JP23  16,16.5 180 top
JP24  23.5,12 270 top
JP26  40,-2 180 top
LED1  76,37.75 270 top
LED2  76,42.88 270 top
R1  49.88,25 270 top
R2  52,25 270 top
R3  60.5,25 90 top
R4  58.38,25 90 top
R5  56.25,25 90 top
R6  54.12,25 90 top
R7  9,75.5 180 top
R8  9,63 180 top
R9  5.5,75.5 0 top
R10  5.5,63 0 top
R11  17.5,75.5 180 top
R12  17.5,63 180 top
R13  14,75.5 0 top
R14  14,63 0 top
R15  28,75.5 180 top
R16  28,63 180 top
R17  24.5,75.5 0 top
R18  24.5,63 0 top
R19  36.5,75.5 180 top
R20  36.5,63 180 top
R21  33,75.5 0 top
R22  33,63 0 top
R23  47,75.5 180 top
R24  47,63 180 top
R25  43.5,75.5 0 top
R26  43.5,63 0 top
R27  55.5,75.5 180 top
R28  55.5,63 180 top
R29  52,75.5 0 top
R30  52,63 0 top
R31  66,75.5 180 top
R32  66,63 180 top
R33  62.5,75.5 0 top
R34  62.5,63 0 top
R35  74.5,75.5 180 top
R36  74.5,63 180 top
R37  71,75.5 0 top
R38  71,63 0 top
R39  36.5,13.12 90 top
R40  47.75,25 90 top
R41  13.12,7.75 0 top
R42  12.25,15.5 90 top
R43  62,16.88 0 top
R44  62,14.75 180 top
R45  62,12.62 0 top
R46  37.62,10 270 top
R47  33.38,10 270 top
R48  45.62,25 270 top
R49  38.62,13.12 270 top
R50  76,40 180 top
R51  76,45 180 top
R52  34.38,13.12 90 top
R53  35.5,10 90 top
TP1  33.88,33.12 0 top
TP2  32.62,33.12 0 top
U1  44.5,34 270 top
U2  6,68 180 top
U3  17,68 180 top
U4  25,68 180 top
U5  36,68 180 top
U6  44,68 180 top
U7  55,68 180 top
U8  63,68 180 top
U9  74,68 180 top
U10  56.25,13.62 90 top
U11  52.5,13.75 0 top
U12  23,32.5 0 top
U13  27.5,17 270 top
U$1  40,92.75 0 top
U$4  40,102 0 top
X1  17.12,9 0 top
X3  5,31 90 top

### Tracks (layer width: path | path; a pad name or v marks a point on that pad's centre or on a via)
+3V3  (3 unrouted)
  Top 0.203: U1.48 48.25,29 49,29.75 53.35,29.75 C4.1 C3.1 56.15,29.6 56.88,28.88 61.75,28.88 | C2.1 57,29.6 | X1.4 15.71,10.25 14,10.25 13.62,9.88 C70.1 13.97,9.72 12.28,8.03 R41.1 | R1.2 49.88,22.5 | R2.2 52,22.5
  Top 0.305: C2.1 C1.1 61.02,29.6 61.75,28.88 61.75,23 61.25,22.5 52,22.5 49.88,22.5 44.8,22.5 43.67,21.38 C79.1 43.67,15.63 | U1.50 51.38,30.75 51.77,30.35 56.25,30.35 57,29.6
  Top 0.406: IC2.1 43.67,15.63
+5V  (4 unrouted)
  Top 0.305: JP3.1 4.35,10.15 11.38,3.12 23.25,3.12
  Top 0.406: JP3.2 JP3.1 | JP2.11 JP2.12 | U10.4 U10.5 54.12,13.62 53.5,13 53.5,12.5 U11.3 53.45,10.65 C74.1 | 49.45,15 IC2.8 47.8,16.7 C80.1 47.62,16.7 47.62,10.75 48.3,10.07 50.52,10.07 C71.1 51.5,9.85 | C74.1 52.75,9.95 | 51.55,11.65 U11.1 51.55,9.9 51.5,9.85 | C74.1 52.65,9.85 51.5,9.85
-5V
  Top 0.406: U10.2 59.33,13.62 59.38,13.68 | C73.2 59.38,13.68 | IC1.3 65.14,11.5 61.5,11.5 61.15,11.85 R45.1 59.45,12.62 C77.1 59.38,13.68
-AIN1
  Top 0.203: JP13.3 9,53 10.38,51.62 10.38,46.75 14.25,42.88 39.25,42.88 41.25,40.88 U1.15
-AIN2
  Top 0.203: JP14.3 16.75,53 15.5,51.75 13.5,51.75 13,51.25 13,49.25 18.12,44.12 39.75,44.12 42.25,41.62 U1.13
-AIN3
  Top 0.203: JP9.3 28,53 29.38,51.62 29.38,46.75 30.62,45.5 40.5,45.5 43.25,42.75 U1.11
-AIN4
  Top 0.203: JP10.3 35.75,53 34.5,51.75 32.5,51.75 32,51.25 32,49.88 35.12,46.75 41.25,46.75 44.25,43.75 U1.9
-AIN5
  Top 0.203: JP15.3 47,53 48.38,51.62 48.38,46.7 45.25,43.58 U1.7
-AIN6
  Top 0.203: JP16.3 54.75,53 53.5,51.75 51.5,51.75 51.12,51.38 51.12,46.7 46.25,41.83 U1.5
-AIN7
  Top 0.203: JP19.3 66,53 67.38,51.62 67.38,48 62.88,43.5 49.62,43.5 47.25,41.12 U1.3
-AIN8
  Top 0.203: JP20.3 73.75,53 72.5,51.75 70.5,51.75 70,51.25 70,49.25 70.75,48.5 70.75,46.25 66.5,42 49.75,42 48.25,40.5 U1.1
-IN1
  Top 0.203: JP5.2 9.85,77.88 R7.1 9.85,78 11.47,79.62 11.47,85.47 14,88 23,88 23.75,88.75 U$1.P$16 23.49,95.51 U$4.3
-IN2
  Top 0.203: R11.1 18.35,77.88 JP6.2 16.77,78.73 15,80.5 15,83 17,85 24,85 28.75,89.75 U$1.P$14 28.57,95.43 U$4.5
-IN3
  Top 0.203: R15.1 28.85,77.88 JP7.2 29.12,78.73 30.5,80.11 30.5,86 33.75,89.25 U$1.P$12 33.65,95.35 U$4.7
-IN4
  Top 0.203: R19.1 37.35,77.88 36.62,78.61 | 36.62,78.61 JP8.2 | 38.73,95.27 U$1.P$10 38.75,95 | 38.75,95 38.75,89.75 37,88 37,84.25 39,82.25 39,79.62 37.99,78.61 36.62,78.61 | U$4.9 38.73,95.02 38.75,95
-IN5
  Top 0.203: R23.1 47.85,77.88 47.12,78.61 | 47.12,78.61 JP11.2 | U$1.P$8 43.81,95.31 | U$1.P$8 43.75,80.25 45.38,78.61 47.12,78.61 | U$4.11 43.81,95.31 | 43.81,95.31 U$1.P$8
-IN6
  Top 0.203: R27.1 56.35,77.88 JP12.2 54.27,78.73 53.25,79.75 53.25,83 48.75,87.5 U$1.P$6 48.89,95.39 U$4.13
-IN7
  Top 0.203: R31.1 66.85,77.88 JP17.2 64.02,78.73 53.75,89 U$1.P$4 53.97,95.47 U$4.15
-IN8
  Top 0.203: R35.1 75.35,77.88 JP18.2 72.14,78.73 71.38,79.5 71.38,82 68.5,84.88 64.12,84.88 58.75,90.25 U$1.P$2 59.05,95.55 U$4.17
-PAS1
  Top 0.203: U2.3 6.63,71.39 7.65,72.4 C21.1 R7.2 8.15,76.35 7.75,76.75 6,76.75 5.5,76.25 5.5,74.75 5,74.25 3.5,74.25 2.5,73.25 2.5,57.25 4,55.75 4,50.5 5.25,49.25 7.56,49.25 JP13.1
-PAS2
  Top 0.203: R11.2 C26.1 16.65,72.35 17.64,71.36 | U3.3 17.64,71.36 | 17.64,71.36 17.64,71.39 18,71.75 19.25,71.75 20,71 20,58 18.5,56.5 18.5,51.5 17.5,50.5 16.81,50.5 JP14.1
-PAS3
  Top 0.203: U4.3 25.64,71.39 26.65,72.4 C33.1 R15.2 27.15,76.35 26.75,76.75 25,76.75 24.5,76.25 24.5,74.75 24,74.25 22.5,74.25 21.5,73.25 21.5,57.75 23,56.25 23,50.5 24.25,49.25 26.56,49.25 JP9.1
-PAS4
  Top 0.203: R19.2 C39.1 35.65,72.35 36.63,71.36 | U5.3 36.63,71.36 | 36.63,71.36 36.63,71.39 37,71.75 38.25,71.75 39,71 39,58 37.5,56.5 37.5,51.5 36.5,50.5 35.81,50.5 JP10.1
-PAS5
  Top 0.203: U6.3 44.63,71.39 45.65,72.4 C45.1 R23.2 46.15,76.35 45.75,76.75 44,76.75 43.5,76.25 43.5,74.75 43,74.25 41.5,74.25 40.5,73.25 40.5,57.75 42,56.25 42,50.5 43.25,49.25 45.56,49.25 JP15.1
-PAS6
  Top 0.203: R27.2 C51.1 54.65,72.35 55.63,71.36 | U7.3 55.63,71.36 | 55.63,71.36 55.63,71.39 56,71.75 57.25,71.75 58,71 58,58 56.5,56.5 56.5,51.5 55.5,50.5 54.81,50.5 JP16.1
-PAS7
  Top 0.203: U8.3 63.63,71.39 64.65,72.4 C57.1 R31.2 65.15,76.35 64.75,76.75 63,76.75 62.5,76.25 62.5,74.75 62,74.25 60.5,74.25 59.5,73.25 59.5,57.75 61,56.25 61,50.5 62.25,49.25 64.56,49.25 JP19.1
-PAS8
  Top 0.203: R35.2 C63.1 73.65,72.35 74.64,71.36 | U9.3 74.64,71.36 | 74.64,71.36 74.64,71.39 75,71.75 76.25,71.75 77,71 77,58 75.5,56.5 75.5,51.5 74.5,50.5 73.81,50.5 JP20.1
A+AIN1
  Top 0.203: U2.8 U2.9 4.73,64.52 5.5,63.75 5.5,56.27 JP13.6
A+AIN2
  Top 0.203: U3.9 U3.8 15.1,64.84 14,63.75 14,55.77 JP14.6
A+AIN3
  Top 0.203: U4.8 U4.9 23.73,64.52 24.5,63.75 24.5,56.27 JP9.6
A+AIN4
  Top 0.203: U5.9 U5.8 34.09,64.84 33,63.75 33,55.77 JP10.6
A+AIN5
  Top 0.203: U6.8 U6.9 42.73,64.52 43.5,63.75 43.5,56.27 JP15.6
A+AIN6
  Top 0.203: U7.9 U7.8 53.09,64.84 52,63.75 52,55.77 JP16.6
A+AIN7
  Top 0.203: U8.8 U8.9 61.73,64.52 62.5,63.75 62.5,56.27 JP19.6
A+AIN8
  Top 0.203: U9.9 U9.8 72.09,64.84 71,63.75 71,55.77 JP20.6
A-AIN1
  Top 0.203: U2.13 U2.14 7.91,64.84 9,63.75 9,55.77 JP13.5
A-AIN2
  Top 0.203: U3.14 U3.13 18.27,64.52 17.5,63.75 17.5,56.27 JP14.5
A-AIN3
  Top 0.203: U4.13 U4.14 26.91,64.84 28,63.75 28,55.77 JP9.5
A-AIN4
  Top 0.203: U5.14 U5.13 37.27,64.52 36.5,63.75 36.5,56.27 JP10.5
A-AIN5
  Top 0.203: U6.13 U6.14 45.91,64.84 47,63.75 47,55.77 JP15.5
A-AIN6
  Top 0.203: U7.14 U7.13 56.27,64.52 55.5,63.75 55.5,56.27 JP16.5
A-AIN7
  Top 0.203: U8.13 U8.14 64.91,64.84 66,63.75 66,55.77 JP19.5
A-AIN8
  Top 0.203: U9.14 U9.13 75.27,64.52 74.5,63.75 74.5,56.27 JP20.5
ADC-CS
  Top 0.203: U1.39 43.75,26.75 37.5,20.5 37.5,10.97 R46.1
ADC-DAISY_IN  (via drill 0.35)
  Top 0.203: U1.41 44.75,26.5 39.5,21.25 39.5,11 v39.38,11 | JP3.9 5.69,21.81 8,19.5 8,9.75 12.5,5.25 27.38,5.25 29.5,7.38 v30.12,7.38
  Bottom 0.203: v30.12,7.38 30.12,9 32.12,11 v39.38,11
ADC-DRDY
  Top 0.203: R40.2 U1.47
ADC-MISO
  Top 0.203: U1.43 45.75,25.98 R48.1
ADC-MOSI
  Top 0.203: U1.34 41.25,27.38 33.38,19.5 R47.1
ADC-PWDN
  Top 0.203: U1.35 41.75,27.25 34.38,19.88 R52.2
ADC-RST  (via drill 0.35)
  Top 0.203: R53.2 35.5,20.38 42.25,27.12 U1.36 42.25,29.38 43.75,30.88 v44.25,30.88 | v49.62,27.5 49.88,27.25 R1.1
  Bottom 0.203: v49.62,27.5 49.62,27.88 48.12,29.38 45.75,29.38 v44.25,30.88
ADC-SCLK
  Top 0.203: U1.40 44.25,26.62 38.62,21 R49.1
ADC-START
  Top 0.203: U1.38 43.25,26.88 37,20.62 37,15.72 36.5,15.22 R39.2
ADC_CLK  (via drill 0.35)
  Top 0.203: U1.37 42.75,27 36.25,20.5 v36.25,16.75 | U13.P$5 v29.5,16.25
  Bottom 0.203: v36.25,16.75 30,16.75 v29.5,16.25
ADC_CLK_OUT  (1 unrouted)
AIN1
  Top 0.203: JP13.4 7.48,51.75 9.5,51.75 10,51.25 10,46.5 14,42.5 39,42.5 40.75,40.75 U1.16
AIN2
  Top 0.203: JP14.4 14,53 12.62,51.62 12.62,49 17.88,43.75 39.38,43.75 41.75,41.38 U1.14
AIN3
  Top 0.203: JP9.4 26.48,51.75 28.5,51.75 29,51.25 29,46.5 30.38,45.12 40.25,45.12 42.75,42.62 U1.12
AIN4
  Top 0.203: JP10.4 33,53 31.62,51.62 31.62,49.62 34.88,46.38 41,46.38 43.75,43.62 U1.10
AIN5
  Top 0.203: JP15.4 45.48,51.75 47.5,51.75 48,51.25 48,46.95 44.75,43.7 U1.8
AIN6
  Top 0.203: JP16.4 52,53 50.75,51.75 50.75,46.95 45.75,41.95 U1.6
AIN7
  Top 0.203: JP19.4 64.48,51.75 66.5,51.75 67,51.25 67,48.25 62.62,43.88 49.38,43.88 46.75,41.25 U1.4
AIN8
  Top 0.203: JP20.4 71,53 69.62,51.62 69.62,48.88 70.38,48.12 70.38,46.5 66.25,42.38 49.5,42.38 47.75,40.62 U1.2
CLKSEL  (via drill 0.35)
  Top 0.203: U1.52 v51.88,31.75 | v51.75,28.75 52,28.5 R2.1
  Bottom 0.203: v51.88,31.75 51.88,28.88 v51.75,28.75
CS  (via drill 0.35)
  Top 0.203: JP26.4 42.5,3.12 42.5,4.75 41.73,5.53 41.25,5.53 R46.2 | v50.38,5.5 50.75,5.5 51.75,6.5 69,6.5 69.5,7 69.5,18.2 JP2.1 | v31.38,8.38 31.25,8.25 29.75,8.25 27.25,5.75 12.75,5.75 8.5,10 8.5,21 v7.5,22
  Bottom 0.203: v7.5,22 5.15,24.35 JP3.11 | v50.38,5.5 49.62,6.25 47.88,6.25 47.38,6.75 42.4,6.75 40,9.15 R46.2 36.77,10 32.62,10 31.38,8.75 v31.38,8.38
  other vias: 37.62,9.15
DRDY  (1 unrouted)
  Top 0.203: R40.1 46.88,23.27 43.27,23.27 40.62,20.62 40.62,10.38 46.35,4.65 JP26.1
EXT-CLK
  Top 0.203: X3.1 5,27 6.12,25.88 6.12,23.12 | 6.12,23.12 7.88,23.12 12,19 15.77,19 17.27,17.5 JP23.1 19.23,14.54 JP24.1 | 6.12,23.12 3.5,23.12 arc90 2.25,21.88 1.88,21.88 JP3.10
EXT-OSC
  Top 0.203: X1.3 22.86,10.1 JP24.3
GND  (via drill 0.35)  (62 unrouted)
  other vias: 49.62,17 45.62,16.88 52.88,8.12 57.62,11.75 59.38,17 53.88,16.88 57.62,16.88 66.88,16.88 61.12,16.88 52.5,13.75 59.38,10.75 50.75,8.12 49.5,13.12 44.25,13.12 18.38,7.88 12.25,9.88 12.25,14.62 23.12,17.5 26.38,15.62 33.38,35.62 33.38,40.62 35.5,40.62 35.5,35.62 53.5,40.25 55.62,40.25 53.5,36.88 55.62,36.88 57.75,36.88 59.88,36.88 55.62,31.25 53.5,31.25 53.5,27.88 55.62,27.88 57.75,27.88 59.88,27.88 54.12,24.12 56.25,24.12 58.38,24.12 60.5,24.12 6,68 17,68 25,68 36,68 44,68 55,68 63,68 74,68 4.62,73 9.88,73 13.12,73 18.38,73 23.62,73 28.88,73 32.12,73 37.38,73 42.62,73 47.88,73 51.12,73 56.38,73 61.62,73 66.88,73 70.12,73 75.38,73 67.5,71 70,71 67.5,65.12 70,65.12 66.88,60.5 61.62,60.5 70.12,60.5 75.38,60.5 56.38,60.5 51.12,60.5 51,71 48.5,71 48.5,65.12 51,65.12 47.88,60.5 42.62,60.5 37.38,60.5 32.12,60.5 28.88,60.5 23.5,60.5 29.5,65.12 29.5,71 32,71 32,65.12 40,74.5 40,56.5 59,56.5 59,74.5 21,74.5 21,56.5
  pour Top (isolate 0.305, rank 6): 80,0 80,47 72,47 72,26 71.25,26 71.25,47.75 80,47.75 80,100 0,100 0,41.5 29.38,41.5 29.38,40.88 11.62,40.88 11.62,24.12 29.62,24.12 29.62,23.88 11.38,23.88 11.25,40.5 0,40.5 0,0
GPIO1  (via drill 0.35)
  Top 0.203: U1.42 45.25,30.38 v45.75,30.88
  Bottom 0.203: v45.75,30.88 45.75,30.75 46.75,29.75 48.35,29.75 52.88,25.23 59.88,25.23 R3.2
  other vias: 60.5,25.85
GPIO2  (via drill 0.35)
  Top 0.203: U1.44 46.25,30 46.75,30.5 v46.75,31.5
  Bottom 0.203: R4.2 58.12,25.6 53.02,25.6 48.5,30.12 47.12,30.12 46.75,30.5 v46.75,31.5
  other vias: 58.38,25.85
GPIO3
  Top 0.203: R5.2 55.4,25 47.12,25 46.75,25.38 U1.45
GPIO4  (via drill 0.35)  (1 unrouted)
  Top 0.203: U1.46 47.25,30.12 v48,30.88
  Bottom 0.203: v54.12,26.23 53.88,25.98 53.25,25.98 48.35,30.88 v48,30.88
IN1
  Top 0.203: R9.1 4.65,76.65 6.5,78.5 6.5,82.5 13,89 20,89 U$1.P$17 20.95,90.55 U$4.2
IN2
  Top 0.203: R13.1 13.15,77.15 14,78 14,83.5 16.5,86 23.5,86 26.25,88.75 U$1.P$15 26.03,90.47 U$4.4
IN3
  Top 0.203: R17.1 23.65,76.15 25.5,78 25.5,83 31,88.5 31,90 U$1.P$13 31.11,90.39 U$4.6
IN4
  Top 0.203: R21.1 32.15,76.15 34,78 34,82.38 36,84.38 36,90 U$1.P$11 36.19,90.31 U$4.8
IN5
  Top 0.203: R25.1 42.65,88.85 U$1.P$9 41.27,90.27 U$4.10
IN6
  Top 0.203: R29.1 51.15,76.15 52.25,77.25 52.25,82.75 46.38,88.62 46.38,90.12 U$1.P$7 46.35,90.35 U$4.12
IN7
  Top 0.203: R33.1 61.65,79.6 51.25,90 U$1.P$5 51.43,90.43 U$4.14
IN8
  Top 0.203: R37.1 70.15,81.6 68.12,83.62 62.88,83.62 U$1.P$3 56.51,90.51 U$4.16
MISO  (via drill 0.35)
  Top 0.203: JP3.7 5.73,19.27 7.5,17.5 7.5,9.5 12.25,4.75 27.5,4.75 28.75,6 29.75,6 v31.25,4.5 | JP2.5 73.77,19.27 70.5,16 70.5,6.5 69.5,5.5 52.12,5.5 50.19,3.56 48.1,3.56 JP26.2 45.12,3.04 45.12,4.71 40.12,9.71 40.12,20.75 43.52,24.15 R48.2
  Bottom 0.203: JP26.2 45.03,3.12 32.62,3.12 v31.25,4.5
MOSI  (via drill 0.35)
  Top 0.203: JP2.3 74.81,21.81 70,17 70,6.75 69.25,6 52,6 50.5,4.5 50,4.5 v49,5.5 | JP26.8 37.5,3.04 37.5,4.88 33.38,9 R47.2
  Bottom 0.203: R47.2 36.62,9.15 37.52,8.25 40.38,8.25 42.25,6.38 47.12,6.38 48,5.5 v49,5.5
  other vias: 33.38,9.15
N$1
  Top 0.203: X1.1 14.12,7.9 R41.2
N$2
  Top 0.203: C36.1 R16.2 27,63 25.64,64.36 U4.12
N$3  (via drill 0.3)
  Top 0.203: U4.2 U4.1 | 26.91,70.34 U4.1 | R16.1 28.85,63.65 27.5,65 v27.5,66.5 | U4.1 26.91,70.09 v27.5,69.5
  Bottom 0.203: v27.5,66.5 v27.5,69.5
N$4
  Top 0.203: C28.1 R10.2 6.35,63.65 5.37,64.64 U2.10
N$5
  Top 0.203: C24.1 R8.2 8,63 6.63,64.36 U2.12
N$6  (via drill 0.3)
  Top 0.203: U2.2 U2.1 | 7.91,70.34 U2.1 | R8.1 9.85,63.65 8.5,65 v8.5,66.5 | U2.1 7.91,70.09 v8.5,69.5
  Bottom 0.203: v8.5,66.5 v8.5,69.5
N$7
  Top 0.203: U2.6 U2.7 4.09,70.09 3.5,69.5 3.5,64.15 R10.1
N$8
  Top 0.203: C38.1 R18.2 25.35,63.65 24.36,64.64 U4.10
N$9
  Top 0.203: C30.1 R12.2 16.65,63.65 17.64,64.64 U3.12
N$10
  Top 0.203: U3.2 U3.1 18.91,70.09 19.5,69.5 19.5,64.15 R12.1
N$11
  Top 0.203: U4.6 U4.7 23.09,70.09 22.5,69.5 22.5,64.15 R18.1
N$12
  Top 0.203: U3.10 16.36,64.36 15,63 R14.2 C32.1
N$13  (via drill 0.3)
  Top 0.203: U3.6 U3.7 15.1,70.09 v14.5,69.5 | v14.5,66.5 14.5,64.85 13.15,63.5 R14.1
  Bottom 0.203: v14.5,66.5 v14.5,69.5
N$206
  Top 0.203: C42.1 R20.2 35.65,63.65 36.63,64.64 U5.12
N$207
  Top 0.203: U5.2 U5.1 37.91,70.09 38.5,69.5 38.5,64.15 R20.1
N$208
  Top 0.203: U5.10 35.37,64.36 34,63 R22.2 C44.1
N$209  (via drill 0.3)
  Top 0.203: U5.6 U5.7 34.09,70.09 v33.5,69.5 | v33.5,66.5 33.5,64.85 32.15,63.5 R22.1
  Bottom 0.203: v33.5,66.5 v33.5,69.5
N$2577
  Top 0.203: C48.1 R24.2 46,63 44.63,64.36 U6.12
N$2578  (via drill 0.3)
  Top 0.203: U6.2 U6.1 | 45.91,70.34 U6.1 | R24.1 47.85,63.65 46.5,65 v46.5,66.5 | U6.1 45.91,70.09 v46.5,69.5
  Bottom 0.203: v46.5,66.5 v46.5,69.5
N$2579
  Top 0.203: C50.1 R26.2 44.35,63.65 43.37,64.64 U6.10
N$2580
  Top 0.203: U6.6 U6.7 42.09,70.09 41.5,69.5 41.5,64.15 R26.1
N$2581
  Top 0.203: C54.1 R28.2 54.65,63.65 55.63,64.64 U7.12
N$2582
  Top 0.203: U7.2 U7.1 56.91,70.09 57.5,69.5 57.5,64.15 R28.1
N$2583
  Top 0.203: U7.10 54.37,64.36 53,63 R30.2 C56.1
N$2584  (via drill 0.3)
  Top 0.203: U7.6 U7.7 53.09,70.09 v52.5,69.5 | v52.5,66.5 52.5,64.85 51.15,63.5 R30.1
  Bottom 0.203: v52.5,66.5 v52.5,69.5
N$2585
  Top 0.203: C60.1 R32.2 65,63 63.63,64.36 U8.12
N$2586  (via drill 0.3)
  Top 0.203: U8.2 U8.1 | 64.91,70.34 U8.1 | R32.1 66.85,63.65 65.5,65 v65.5,66.5 | U8.1 64.91,70.09 v65.5,69.5
  Bottom 0.203: v65.5,66.5 v65.5,69.5
N$2587
  Top 0.203: C62.1 R34.2 63.35,63.65 62.37,64.64 U8.10
N$2588
  Top 0.203: U8.6 U8.7 61.09,70.09 60.5,69.5 60.5,64.15 R34.1
N$2589
  Top 0.203: C66.1 R36.2 73.65,63.65 74.64,64.64 U9.12
N$2590
  Top 0.203: U9.2 U9.1 75.91,70.09 76.5,69.5 76.5,64.15 R36.1
N$2591
  Top 0.203: U9.10 73.36,64.36 72,63 R38.2 C68.1
N$2592  (via drill 0.3)
  Top 0.203: U9.6 U9.7 72.09,70.09 v71.5,69.5 | v71.5,66.5 71.5,64.85 70.15,63.5 R38.1
  Bottom 0.203: v71.5,66.5 v71.5,69.5
N$6434
  Top 0.406: 54.98,10.32 C72.1 54.95,10.35 U10.6
N$6435
  Top 0.305: C72.2 57,10.3
  Top 0.406: U10.3 56.58,14.57 56,14 56,12 56.95,11.05 C72.2
N$6436  (1 unrouted)
  Top 0.203: JP24.2 26.5,12 27.25,12.75
N$6437
  Top 0.203: R42.2 12.4,16.5 JP23.2
N$6438
  Top 0.406: U11.4 53.9,15.5 55,15.5 55.9,16.4 C76.1
N$6439
  Top 0.406: IC1.1 65.33,14.27 64.85,14.75 R44.1 R45.2
N$6444
  Top 0.203: LED2.C 77.05,44.8 R51.1
N$6445
  Top 0.203: LED1.C 77.05,39.3 R50.1
PAS1
  Top 0.203: R9.2 C25.1 6.35,72.35 5.37,71.36 | 5.37,71.36 U2.5 | 5.37,71.36 4.73,72 3.75,72 3,71.25 3,57.5 4.5,56 4.5,51.25 5.25,50.5 6.19,50.5 JP13.2
PAS2
  Top 0.203: U3.5 16.36,71.14 14.85,72.65 C31.1 R13.2 14.85,76.35 15.5,77 17,77 17.5,76.5 17.5,74.75 18,74.25 19.5,74.25 20.5,73.25 20.5,57.75 19,56.25 19,50.75 17.5,49.25 15.44,49.25 JP14.2
PAS3  (1 unrouted)
  Top 0.203: 24.36,71.36 25.35,72.35 | 24.36,71.36 23.73,72 22.75,72 22,71.25 22,58 23.5,56.5 23.5,51.25 24.25,50.5 25.19,50.5 JP9.2 | R17.2 C37.1 | 24.36,71.36 U4.5
PAS4  (1 unrouted)
  Top 0.152: 38,50.88 38,56.25
  Top 0.203: R21.2 C43.1 33.85,72.65 35.37,71.14 U5.5 | 33.85,76.35 34.5,77 36,77 36.5,76.5 36.5,74.75 37,74.25 38.5,74.25 39.5,73.25 39.5,57.75 38,56.25 | JP10.2 34.31,49.25 36.38,49.25 38,50.88
PAS5  (1 unrouted)
  Top 0.203: R25.2 C49.1 | 43.37,71.36 44.35,72.35 | 43.37,71.36 42.73,72 41.75,72 41,71.25 41,58 42.5,56.5 42.5,51.25 43.25,50.5 44.19,50.5 JP15.2 | 43.37,71.36 U6.5
PAS6
  Top 0.203: U7.5 54.37,71.14 52.85,72.65 C55.1 R29.2 52.85,76.35 53.5,77 55,77 55.5,76.5 55.5,74.75 56,74.25 57.5,74.25 58.5,73.25 58.5,57.75 57,56.25 57,50.75 55.5,49.25 53.44,49.25 JP16.2
PAS7  (1 unrouted)
  Top 0.203: R33.2 C61.1 | 62.37,71.36 63.35,72.35 | 62.37,71.36 61.73,72 60.75,72 60,71.25 60,58 61.5,56.5 61.5,51.25 62.25,50.5 63.19,50.5 JP19.2 | 62.37,71.36 U8.5
PAS8
  Top 0.203: U9.5 73.36,71.14 71.85,72.65 C67.1 R37.2 71.85,76.35 72,76.5 72.5,77 74,77 74.5,76.5 74.5,74.75 75,74.25 76.5,74.25 77.5,73.25 77.5,57.75 76,56.25 76,50.75 74.5,49.25 72.44,49.25 JP20.2
PWDN
  Top 0.203: JP26.7 34.38,8.71 R52.1
RST
  Top 0.203: JP26.6 40.12,2.96 40.12,4.75 39.35,5.53 38.5,5.53 35.5,8.53 R53.1
SCLK  (via drill 0.35)
  Top 0.203: 38.62,11.88 R49.2 38.62,9.49 43.77,4.35 JP26.3 | JP3.5 5.77,16.73 7,15.5 7,9.25 12,4.25 27.62,4.25 28.88,5.5 29.5,5.5 30.12,4.88 v30.12,3.38 | JP2.7 72.73,16.73 71,15 71,6.25 69.75,5 52.5,5 50.12,2.62 v48.62,2.62
  Bottom 0.203: v48.62,2.62 48.62,3.66 46.66,5.62 43.75,5.62 | 43.75,5.62 31.25,5.62 30.12,4.5 v30.12,3.38 | JP26.3 43.81,5.57 43.75,5.62
START  (via drill 0.35)
  Top 0.203: JP2.8 76.96,15.5 73,15.5 71.5,14 71.5,6 70,4.5 52.75,4.5 49.88,1.62 v49.62,1.62 | JP3.6 1.81,16.69 3,15.5 5.75,15.5 6.5,14.75 6.5,9 11.75,3.75 28.25,3.75 v29,4.5 | R39.1 36.5,8.62 v37.81,7.31 39.06,6.06 39.81,6.06 41.27,4.61 JP26.5
  Bottom 0.203: v49.62,1.62 49.62,3.25 46.88,6 37.75,6 | 37.75,6 30.5,6 v29,4.5 | v37.81,7.31 37.81,6.06 37.75,6
VCAP1
  Top 0.203: C15.1 35.98,30.73 37.5,32.25 U1.28
VCAP2
  Top 0.203: C16.1 37,28.4 37,30.5 37.75,31.25 U1.30
VCAP3
  Top 0.203: C17.1 C18.1 56.85,33.88 52.5,33.88 51.88,33.25 U1.55
VCAP4
  Top 0.203: C19.1 34.27,31.62 36.12,31.62 37.75,33.25 U1.26
VCC  (via drill 0.3, 0.35)  (2 unrouted)
  Top 0.203: C8.1 C7.1 33.38,38.25 | 35.5,38.62 C8.1 | U1.22 U1.21 37.6,35.75 35.85,37.5 35.5,37.5 C6.1 C5.1 33.38,38.25 | C14.1 C13.1 53.27,32.75 U1.54 | U1.56 51.5,33.75 52,34.25 56.85,34.25 C10.1 C9.1 63,35.15 | U3.4 17,69.5 16,68.5 13.65,68.5 C27.1 11.75,69.15 | U2.4 6,69.5 7,68.5 9.85,68.5 C22.1 11.75,69.15 | 30.75,69.15 C34.1 28.85,68.5 26,68.5 25,69.5 U4.4 | 30.75,69.15 C40.1 32.65,68.5 35,68.5 36,69.5 U5.4 | 49.75,69.15 C46.1 47.85,68.5 45,68.5 44,69.5 U6.4 | 49.75,69.15 C52.1 51.65,68.5 54,68.5 55,69.5 U7.4 | 68.75,69.15 C58.1 66.85,68.5 64,68.5 63,69.5 U8.4 | 68.75,69.15 C64.1 70.65,68.5 73,68.5 74,69.5 U9.4 | U12.2 U12.1 20.27,33.77 19.85,33.35 C69.1 C83.1 16,36.5 17.75,38.25 33.38,38.25 | 68.75,69.15 v68.75,68 | v69,63 69,62.38 68.73,62.11 68.73,47.23 67.25,45.75 v67.25,45.5 | 11.75,69.15 v11.75,68 | v11.88,63 11.62,62.75 11.62,48.5 v12.12,48 | 30.75,69.15 v30.75,68 | v30.75,63 30.75,49.12 v31.38,48.5 | v27,48 26.5,47.5 17.38,47.5 16.88,48 v15.88,48 | 49.75,69.15 v49.75,68 | v49.75,63 49.75,47.75 v50,47.5 | v46.75,47.5 45.62,47.5 45,48.12 37.38,48.12 37,48.5 v36,48.5 | v64.5,47.5 63.5,47.5 63,47 53.5,47 v53,47.5 | U1.19 37.65,36.75 35.62,38.77 C8.1 | 51.92,17.43 51.92,17 C75.1 | U1.59 51.5,35.25 52.38,36.12 52.38,37.38 53.5,38.5 C11.1 C12.1 62.98,38.52 63,38.5
  Top 0.305: v62.62,39.38 63,39 63,38.5 63,35.15 63,21.2 60.3,18.5 53.17,18.5 51.92,17.25 C75.1
  Top 0.406: U11.5 51.55,16.62 51.92,17
  Bottom 0.203: v68.75,68 arc-90 69,67.75 v69,63 | v11.75,68 12,67.75 12,63.12 v11.88,63 | v15.88,48 v12.12,48 | v30.75,68 31,67.75 31,63.25 v30.75,63 | v27,48 28,48 28.5,48.5 v31.38,48.5 v36,48.5 | v49.75,68 50,67.75 50,63.25 v49.75,63 | v46.75,47.5 v50,47.5 v53,47.5 | v62.62,39.38 63.5,38.5 65.12,38.5 67.25,40.62 v67.25,45.5 65.25,47.5 v64.5,47.5
VREF
  Top 0.203: U1.24 35.52,34.25 C20.1 | C20.1 34.4,33.12 TP1.P$1 | U12.6 26.38,32.5 27.85,33.98 35.25,33.98 C20.1 | U12.7 26.02,33.77 26.63,34.38 35.35,34.38 C20.1
VSS  (via drill 0.35)  (7 unrouted)
  Top 0.203: U3.11 17,66.5 16,67.5 13.65,67.5 C29.1 11.5,66.85 | 11.5,66.85 C23.1 10.15,66.85 9.5,67.5 7,67.5 6,66.5 U2.11 | U5.11 36,66.5 35,67.5 32.65,67.5 C41.1 30.5,66.85 | 30.5,66.85 C35.1 29.15,66.85 28.5,67.5 26,67.5 25,66.5 U4.11 | U7.11 55,66.5 54,67.5 51.65,67.5 C53.1 49.5,66.85 | U6.11 44,66.5 45,67.5 47.5,67.5 48.15,66.85 C47.1 49.5,66.85 | U9.11 74,66.5 73,67.5 70.65,67.5 C65.1 68.5,66.85 | 68.5,66.85 C59.1 67.15,66.85 66.5,67.5 64,67.5 63,66.5 U8.11 | U1.58 U1.57 51.35,34.25 52.25,35.15 C81.1 C82.1 | C69.2 19.85,31.65 20.27,31.23 U12.3 | U1.25 37.25,33.75 36.02,32.52 C20.2 35.1,32.12 32.62,32.12 | 32.62,32.12 27.62,32.12 26.73,31.23 U12.5 | 68.5,66.85 68.5,63.62 68,63.12 68,62.88 68.38,62.5 68.38,47.62 66,45.25 66,44.5 v66.12,44.38 | 11.5,66.85 11.5,63.75 11,63.25 11,62.75 11.25,62.5 11.25,47.88 12.12,47 12.88,47 v13,47.12 | 30.5,66.85 30.5,63.88 30,63.38 30,62.62 30.25,62.38 30.25,48.25 30.75,47.75 v32.12,47.75 | v27.88,47.12 v16.75,47.12 | 49.5,66.85 49.5,63.88 48.88,63.25 48.88,62.75 49.25,62.38 49.25,46.75 v49.12,46.62 | v45.88,46.62 44.75,47.75 v36.75,47.75 | v63.62,46.62 v52.12,46.62 | C18.2 C17.2 60.9,31.27 v61.75,32.12 | v64.12,34.25 64,34.25 | C19.2 34.12,29.02 | 34.12,29.02 C15.2 | C16.2 34.15,28.93 34.12,29.02 | TP2.P$1 32.62,32.12
  Top 0.305: 64,34.25 64,38.75 v64.62,39.38 | 63.92,34.25 63.92,17.88 C78.1
  Top 0.406: 64.92,16.45 C78.1 | C78.1 R43.2 61.15,15.18 R44.2 | IC1.2 67.28,14.35 64.92,16.7 C78.1
  Bottom 0.203: v16.75,47.12 16.62,47 13.12,47 v13,47.12 | v27.88,47.12 28.5,47.75 v32.12,47.75 v36.75,47.75 | v45.88,46.62 v49.12,46.62 v52.12,46.62 | C82.1 63.23,35.15 v64.12,34.25 64.12,34 62.25,32.12 v61.75,32.12 | v64.62,39.38 66.12,40.88 v66.12,44.38 63.88,46.62 v63.62,46.62
  other vias: 55.62,35.15
  pour Top (isolate 0.203): 31.5,25.5 31.5,39 13.5,39 13.5,25.5

### Text on the board
tPlace: Voltage Reference | ADC - ADS131E08 | EXT CLK / INPUT | +5V GND | LTC6655 - 4.096V / 0.025% Accuracy / 2 ppm/°C Drift | Clock Configuration | Power Supply | NC / GND / RST / PWDN / DRDY / START | NC / GND / SCLK / MISO / MOSI / CS | 50 Ω | EXT | CLK | OSC
Reference: 0.81786 ns delay per board / 6.54 ns delay to last board / VREF length 3.055mm = 7.13mOhm / Approx 4.87µV drop = 1.2ppm
tDocu: CH1 | CH2 | CH3 | CH4 | CH5 | CH6 | CH7 | CH8 | SINGLE / ENDED | SINGLE / ENDED | SINGLE / ENDED | SINGLE / ENDED | SINGLE / ENDED | SINGLE / ENDED | SINGLE / ENDED | SINGLE / ENDED | PASSIVE | PASSIVE | PASSIVE | PASSIVE | PASSIVE | PASSIVE | PASSIVE | PASSIVE | ACTIVE | ACTIVE | ACTIVE | ACTIVE | ACTIVE | ACTIVE | ACTIVE | ACTIVE | CONV | PWR